# Altium project RGB_Matrix.PrjPcb (part 1 of 2)
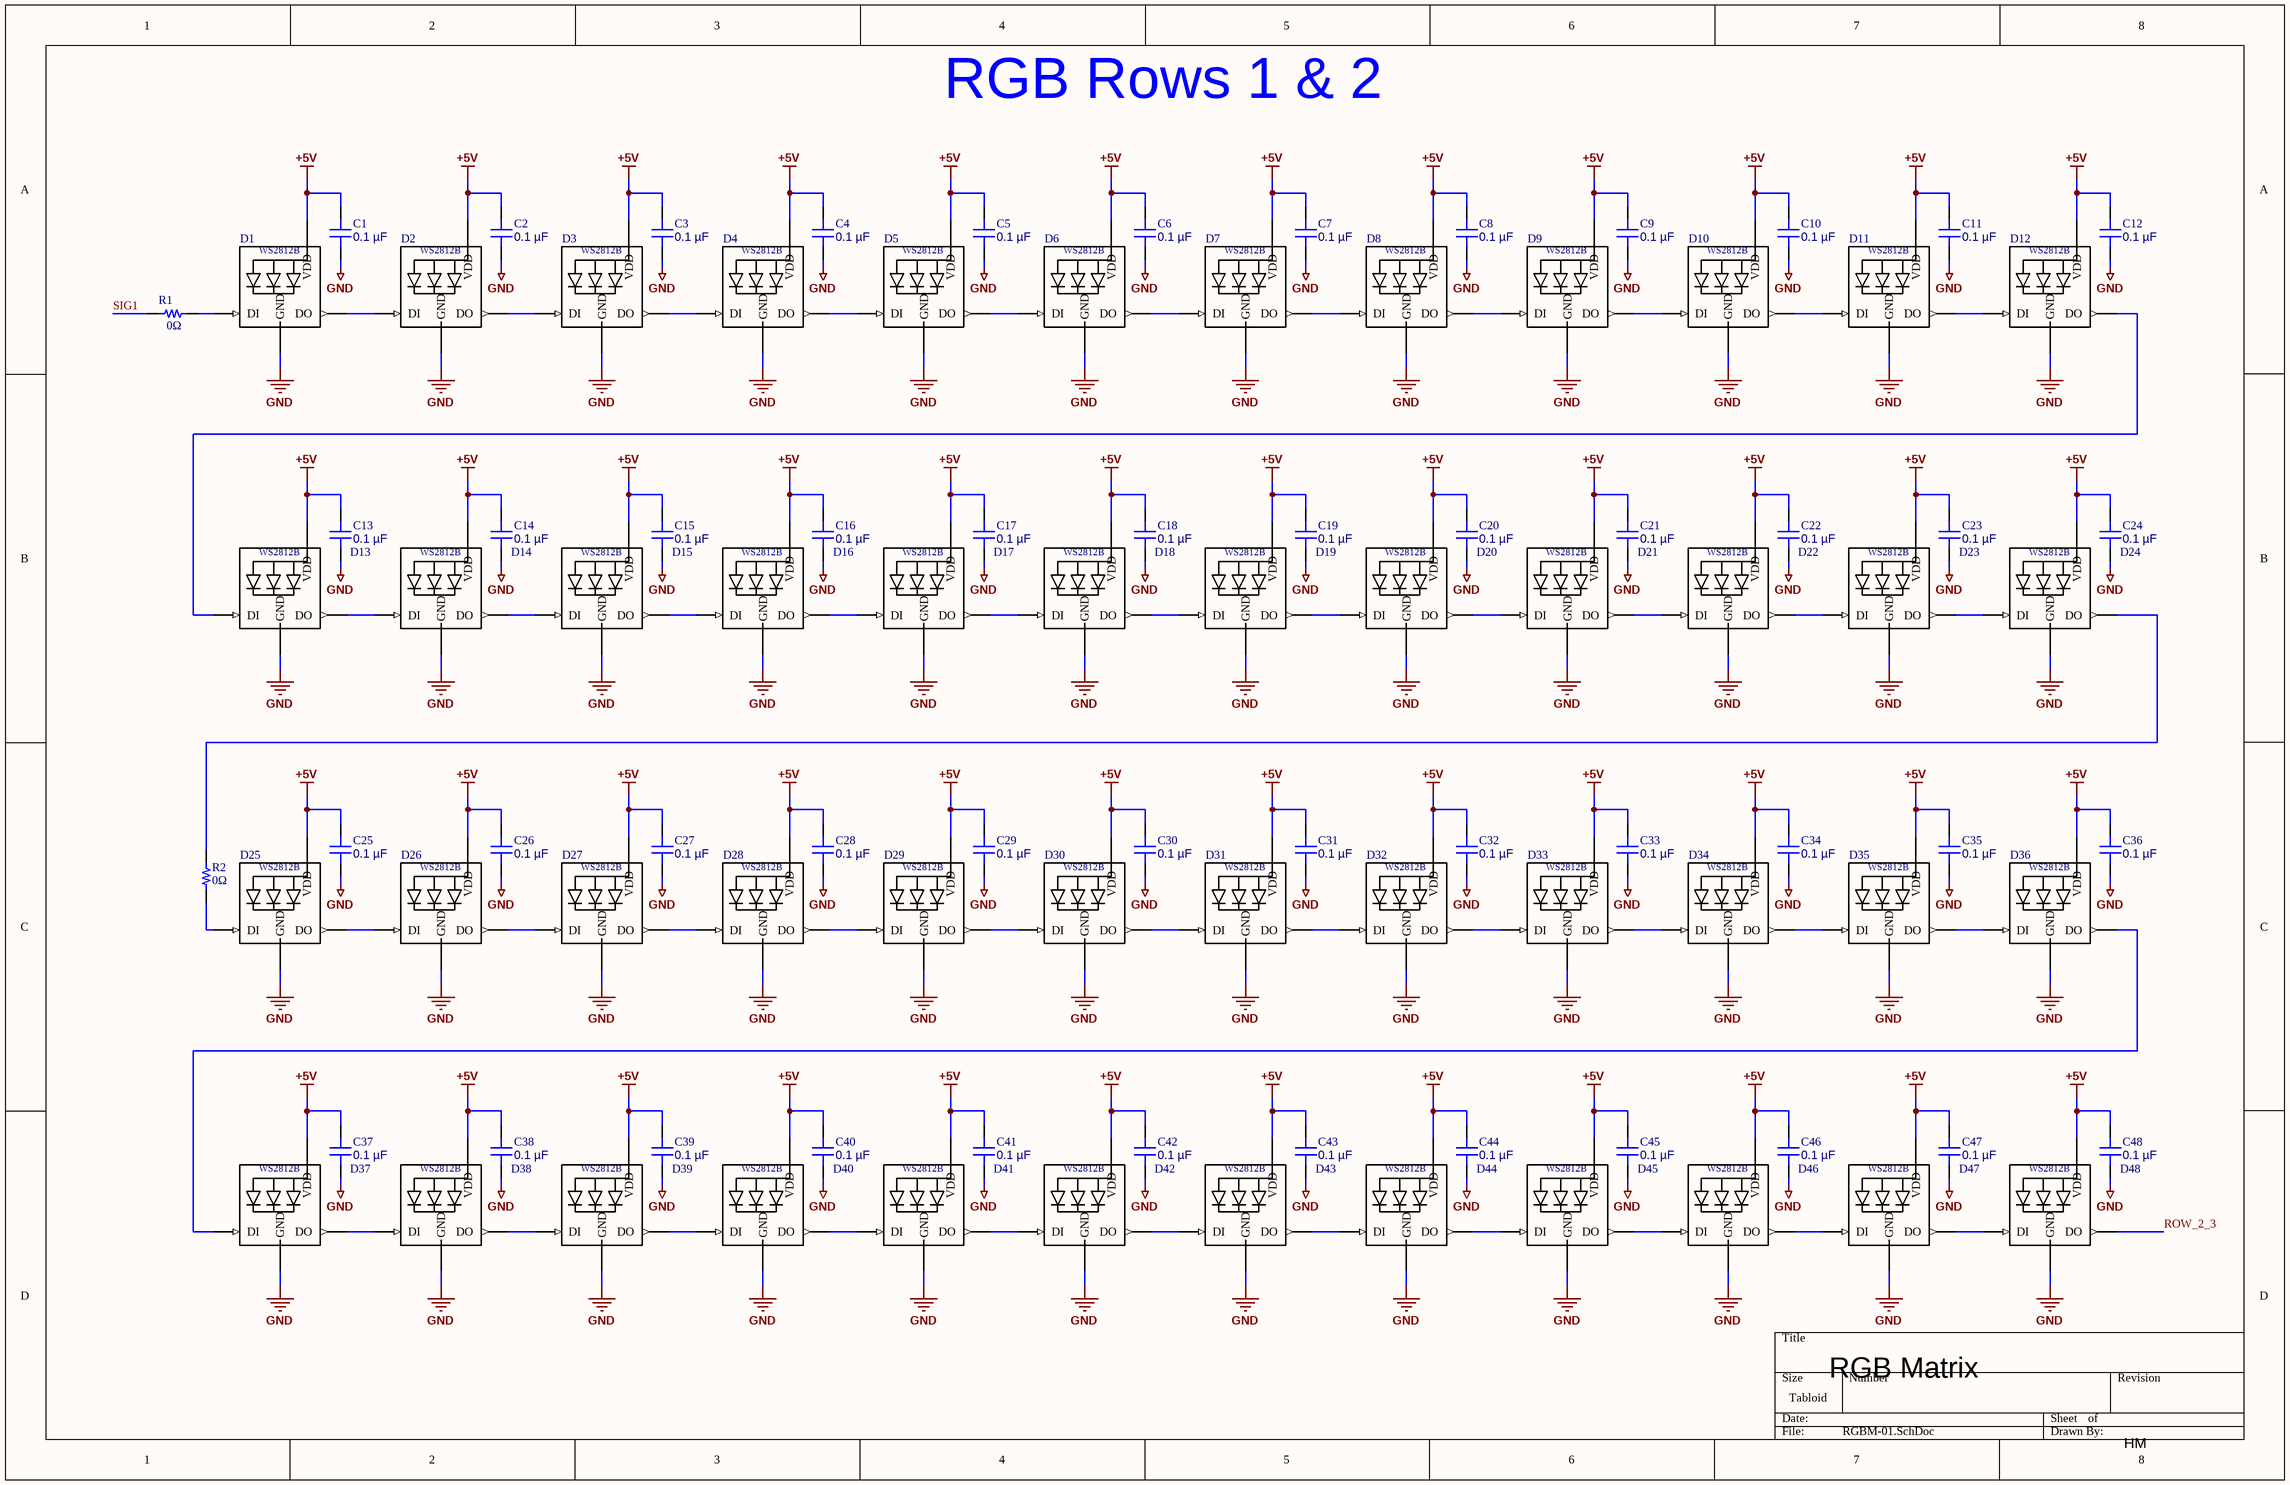
[diagram p0: RGBM-01.SchDoc]
7 sheets, 598 parts. Net scope: global (net labels, ports and power ports of the same name join across sheets).
Board file: RGBM.PcbDoc
Sheets:
  RGBM-01.SchDoc
  RGBM-02.SchDoc
  RGBM-03.SchDoc
  RGBM-04.SchDoc
  RGBM-05.SchDoc
  RGBM-06.SchDoc
  RGBM-07.SchDoc

## Sheet RGBM-01.SchDoc
size Tabloid; SheetNumber: 1; SheetTotal: 7

### Parts
C1  0.1 µF  [CAP 0603_1608]
C2  0.1 µF  [CAP 0603_1608]
C3  0.1 µF  [CAP 0603_1608]
C4  0.1 µF  [CAP 0603_1608]
C5  0.1 µF  [CAP 0603_1608]
C6  0.1 µF  [CAP 0603_1608]
C7  0.1 µF  [CAP 0603_1608]
C8  0.1 µF  [CAP 0603_1608]
C9  0.1 µF  [CAP 0603_1608]
C10  0.1 µF  [CAP 0603_1608]
C11  0.1 µF  [CAP 0603_1608]
C12  0.1 µF  [CAP 0603_1608]
C13  0.1 µF  [CAP 0603_1608]
C14  0.1 µF  [CAP 0603_1608]
C15  0.1 µF  [CAP 0603_1608]
C16  0.1 µF  [CAP 0603_1608]
C17  0.1 µF  [CAP 0603_1608]
C18  0.1 µF  [CAP 0603_1608]
C19  0.1 µF  [CAP 0603_1608]
C20  0.1 µF  [CAP 0603_1608]
C21  0.1 µF  [CAP 0603_1608]
C22  0.1 µF  [CAP 0603_1608]
C23  0.1 µF  [CAP 0603_1608]
C24  0.1 µF  [CAP 0603_1608]
C25  0.1 µF  [CAP 0603_1608]
C26  0.1 µF  [CAP 0603_1608]
C27  0.1 µF  [CAP 0603_1608]
C28  0.1 µF  [CAP 0603_1608]
C29  0.1 µF  [CAP 0603_1608]
C30  0.1 µF  [CAP 0603_1608]
C31  0.1 µF  [CAP 0603_1608]
C32  0.1 µF  [CAP 0603_1608]
C33  0.1 µF  [CAP 0603_1608]
C34  0.1 µF  [CAP 0603_1608]
C35  0.1 µF  [CAP 0603_1608]
C36  0.1 µF  [CAP 0603_1608]
C37  0.1 µF  [CAP 0603_1608]
C38  0.1 µF  [CAP 0603_1608]
C39  0.1 µF  [CAP 0603_1608]
C40  0.1 µF  [CAP 0603_1608]
C41  0.1 µF  [CAP 0603_1608]
C42  0.1 µF  [CAP 0603_1608]
C43  0.1 µF  [CAP 0603_1608]
C44  0.1 µF  [CAP 0603_1608]
C45  0.1 µF  [CAP 0603_1608]
C46  0.1 µF  [CAP 0603_1608]
C47  0.1 µF  [CAP 0603_1608]
C48  0.1 µF  [CAP 0603_1608]
D1  WS2812B  [*WS2812B_WS2812B(Primary)]  (value not drawn)
D2  WS2812B  [*WS2812B_WS2812B(Primary)]  (value not drawn)
D3  WS2812B  [*WS2812B_WS2812B(Primary)]  (value not drawn)
D4  WS2812B  [*WS2812B_WS2812B(Primary)]  (value not drawn)
D5  WS2812B  [*WS2812B_WS2812B(Primary)]  (value not drawn)
D6  WS2812B  [*WS2812B_WS2812B(Primary)]  (value not drawn)
D7  WS2812B  [*WS2812B_WS2812B(Primary)]  (value not drawn)
D8  WS2812B  [*WS2812B_WS2812B(Primary)]  (value not drawn)
D9  WS2812B  [*WS2812B_WS2812B(Primary)]  (value not drawn)
D10  WS2812B  [*WS2812B_WS2812B(Primary)]  (value not drawn)
D11  WS2812B  [*WS2812B_WS2812B(Primary)]  (value not drawn)
D12  WS2812B  [*WS2812B_WS2812B(Primary)]  (value not drawn)
D13  WS2812B  [*WS2812B_WS2812B(Primary)]  (value not drawn)
D14  WS2812B  [*WS2812B_WS2812B(Primary)]  (value not drawn)
D15  WS2812B  [*WS2812B_WS2812B(Primary)]  (value not drawn)
D16  WS2812B  [*WS2812B_WS2812B(Primary)]  (value not drawn)
D17  WS2812B  [*WS2812B_WS2812B(Primary)]  (value not drawn)
D18  WS2812B  [*WS2812B_WS2812B(Primary)]  (value not drawn)
D19  WS2812B  [*WS2812B_WS2812B(Primary)]  (value not drawn)
D20  WS2812B  [*WS2812B_WS2812B(Primary)]  (value not drawn)
D21  WS2812B  [*WS2812B_WS2812B(Primary)]  (value not drawn)
D22  WS2812B  [*WS2812B_WS2812B(Primary)]  (value not drawn)
D23  WS2812B  [*WS2812B_WS2812B(Primary)]  (value not drawn)
D24  WS2812B  [*WS2812B_WS2812B(Primary)]  (value not drawn)
D25  WS2812B  [*WS2812B_WS2812B(Primary)]  (value not drawn)
D26  WS2812B  [*WS2812B_WS2812B(Primary)]  (value not drawn)
D27  WS2812B  [*WS2812B_WS2812B(Primary)]  (value not drawn)
D28  WS2812B  [*WS2812B_WS2812B(Primary)]  (value not drawn)
D29  WS2812B  [*WS2812B_WS2812B(Primary)]  (value not drawn)
D30  WS2812B  [*WS2812B_WS2812B(Primary)]  (value not drawn)
D31  WS2812B  [*WS2812B_WS2812B(Primary)]  (value not drawn)
D32  WS2812B  [*WS2812B_WS2812B(Primary)]  (value not drawn)
D33  WS2812B  [*WS2812B_WS2812B(Primary)]  (value not drawn)
D34  WS2812B  [*WS2812B_WS2812B(Primary)]  (value not drawn)
D35  WS2812B  [*WS2812B_WS2812B(Primary)]  (value not drawn)
D36  WS2812B  [*WS2812B_WS2812B(Primary)]  (value not drawn)
D37  WS2812B  [*WS2812B_WS2812B(Primary)]  (value not drawn)
D38  WS2812B  [*WS2812B_WS2812B(Primary)]  (value not drawn)
D39  WS2812B  [*WS2812B_WS2812B(Primary)]  (value not drawn)
D40  WS2812B  [*WS2812B_WS2812B(Primary)]  (value not drawn)
D41  WS2812B  [*WS2812B_WS2812B(Primary)]  (value not drawn)
D42  WS2812B  [*WS2812B_WS2812B(Primary)]  (value not drawn)
D43  WS2812B  [*WS2812B_WS2812B(Primary)]  (value not drawn)
D44  WS2812B  [*WS2812B_WS2812B(Primary)]  (value not drawn)
D45  WS2812B  [*WS2812B_WS2812B(Primary)]  (value not drawn)
D46  WS2812B  [*WS2812B_WS2812B(Primary)]  (value not drawn)
D47  WS2812B  [*WS2812B_WS2812B(Primary)]  (value not drawn)
D48  WS2812B  [*WS2812B_WS2812B(Primary)]  (value not drawn)
R1  0Ω  [RES 0603_1608]
R2  0Ω  [RES 0603_1608]

### Nets
+5V: C1.2 C2.2 C3.2 C4.2 C5.2 C6.2 C7.2 C8.2 C9.2 C10.2 C11.2 C12.2 C13.2 C14.2 C15.2 C16.2 C17.2 C18.2 C19.2 C20.2 C21.2 C22.2 C23.2 C24.2 C25.2 C26.2 C27.2 C28.2 C29.2 C30.2 C31.2 C32.2 C33.2 C34.2 C35.2 C36.2 C37.2 C38.2 C39.2 C40.2 C41.2 C42.2 C43.2 C44.2 C45.2 C46.2 C47.2 C48.2 D1.1-VDD(VDD) D2.1-VDD(VDD) D3.1-VDD(VDD) D4.1-VDD(VDD) D5.1-VDD(VDD) D6.1-VDD(VDD) D7.1-VDD(VDD) D8.1-VDD(VDD) D9.1-VDD(VDD) D10.1-VDD(VDD) D11.1-VDD(VDD) D12.1-VDD(VDD) D13.1-VDD(VDD) D14.1-VDD(VDD) D15.1-VDD(VDD) D16.1-VDD(VDD) D17.1-VDD(VDD) D18.1-VDD(VDD) D19.1-VDD(VDD) D20.1-VDD(VDD) D21.1-VDD(VDD) D22.1-VDD(VDD) D23.1-VDD(VDD) D24.1-VDD(VDD) D25.1-VDD(VDD) D26.1-VDD(VDD) D27.1-VDD(VDD) D28.1-VDD(VDD) D29.1-VDD(VDD) D30.1-VDD(VDD) D31.1-VDD(VDD) D32.1-VDD(VDD) D33.1-VDD(VDD) D34.1-VDD(VDD) D35.1-VDD(VDD) D36.1-VDD(VDD) D37.1-VDD(VDD) D38.1-VDD(VDD) D39.1-VDD(VDD) D40.1-VDD(VDD) D41.1-VDD(VDD) D42.1-VDD(VDD) D43.1-VDD(VDD) D44.1-VDD(VDD) D45.1-VDD(VDD) D46.1-VDD(VDD) D47.1-VDD(VDD) D48.1-VDD(VDD)
GND: C1.1 C2.1 C3.1 C4.1 C5.1 C6.1 C7.1 C8.1 C9.1 C10.1 C11.1 C12.1 C13.1 C14.1 C15.1 C16.1 C17.1 C18.1 C19.1 C20.1 C21.1 C22.1 C23.1 C24.1 C25.1 C26.1 C27.1 C28.1 C29.1 C30.1 C31.1 C32.1 C33.1 C34.1 C35.1 C36.1 C37.1 C38.1 C39.1 C40.1 C41.1 C42.1 C43.1 C44.1 C45.1 C46.1 C47.1 C48.1 D1.3-GND(GND) D2.3-GND(GND) D3.3-GND(GND) D4.3-GND(GND) D5.3-GND(GND) D6.3-GND(GND) D7.3-GND(GND) D8.3-GND(GND) D9.3-GND(GND) D10.3-GND(GND) D11.3-GND(GND) D12.3-GND(GND) D13.3-GND(GND) D14.3-GND(GND) D15.3-GND(GND) D16.3-GND(GND) D17.3-GND(GND) D18.3-GND(GND) D19.3-GND(GND) D20.3-GND(GND) D21.3-GND(GND) D22.3-GND(GND) D23.3-GND(GND) D24.3-GND(GND) D25.3-GND(GND) D26.3-GND(GND) D27.3-GND(GND) D28.3-GND(GND) D29.3-GND(GND) D30.3-GND(GND) D31.3-GND(GND) D32.3-GND(GND) D33.3-GND(GND) D34.3-GND(GND) D35.3-GND(GND) D36.3-GND(GND) D37.3-GND(GND) D38.3-GND(GND) D39.3-GND(GND) D40.3-GND(GND) D41.3-GND(GND) D42.3-GND(GND) D43.3-GND(GND) D44.3-GND(GND) D45.3-GND(GND) D46.3-GND(GND) D47.3-GND(GND) D48.3-GND(GND)
ROW_2_3: D48.2-DOUT(DO)
SIG1: R1.1
NetD1_2-DOUT: D1.2-DOUT(DO) D2.4-DIN(DI)
NetD1_4-DIN: D1.4-DIN(DI) R1.2
NetD2_2-DOUT: D2.2-DOUT(DO) D3.4-DIN(DI)
NetD3_2-DOUT: D3.2-DOUT(DO) D4.4-DIN(DI)
NetD4_2-DOUT: D4.2-DOUT(DO) D5.4-DIN(DI)
NetD5_2-DOUT: D5.2-DOUT(DO) D6.4-DIN(DI)
NetD6_2-DOUT: D6.2-DOUT(DO) D7.4-DIN(DI)
NetD7_2-DOUT: D7.2-DOUT(DO) D8.4-DIN(DI)
NetD8_2-DOUT: D8.2-DOUT(DO) D9.4-DIN(DI)
NetD9_2-DOUT: D9.2-DOUT(DO) D10.4-DIN(DI)
NetD10_2-DOUT: D10.2-DOUT(DO) D11.4-DIN(DI)
NetD11_2-DOUT: D11.2-DOUT(DO) D12.4-DIN(DI)
NetD12_2-DOUT: D12.2-DOUT(DO) D13.4-DIN(DI)
NetD13_2-DOUT: D13.2-DOUT(DO) D14.4-DIN(DI)
NetD14_2-DOUT: D14.2-DOUT(DO) D15.4-DIN(DI)
NetD15_2-DOUT: D15.2-DOUT(DO) D16.4-DIN(DI)
NetD16_2-DOUT: D16.2-DOUT(DO) D17.4-DIN(DI)
NetD17_2-DOUT: D17.2-DOUT(DO) D18.4-DIN(DI)
NetD18_2-DOUT: D18.2-DOUT(DO) D19.4-DIN(DI)
NetD19_2-DOUT: D19.2-DOUT(DO) D20.4-DIN(DI)
NetD20_2-DOUT: D20.2-DOUT(DO) D21.4-DIN(DI)
NetD21_2-DOUT: D21.2-DOUT(DO) D22.4-DIN(DI)
NetD22_2-DOUT: D22.2-DOUT(DO) D23.4-DIN(DI)
NetD23_2-DOUT: D23.2-DOUT(DO) D24.4-DIN(DI)
NetD24_2-DOUT: D24.2-DOUT(DO) R2.2
NetD25_2-DOUT: D25.2-DOUT(DO) D26.4-DIN(DI)
NetD25_4-DIN: D25.4-DIN(DI) R2.1
NetD26_2-DOUT: D26.2-DOUT(DO) D27.4-DIN(DI)
NetD27_2-DOUT: D27.2-DOUT(DO) D28.4-DIN(DI)
NetD28_2-DOUT: D28.2-DOUT(DO) D29.4-DIN(DI)
NetD29_2-DOUT: D29.2-DOUT(DO) D30.4-DIN(DI)
NetD30_2-DOUT: D30.2-DOUT(DO) D31.4-DIN(DI)
NetD31_2-DOUT: D31.2-DOUT(DO) D32.4-DIN(DI)
NetD32_2-DOUT: D32.2-DOUT(DO) D33.4-DIN(DI)
NetD33_2-DOUT: D33.2-DOUT(DO) D34.4-DIN(DI)
NetD34_2-DOUT: D34.2-DOUT(DO) D35.4-DIN(DI)
NetD35_2-DOUT: D35.2-DOUT(DO) D36.4-DIN(DI)
NetD36_2-DOUT: D36.2-DOUT(DO) D37.4-DIN(DI)
NetD37_2-DOUT: D37.2-DOUT(DO) D38.4-DIN(DI)
NetD38_2-DOUT: D38.2-DOUT(DO) D39.4-DIN(DI)
NetD39_2-DOUT: D39.2-DOUT(DO) D40.4-DIN(DI)
NetD40_2-DOUT: D40.2-DOUT(DO) D41.4-DIN(DI)
NetD41_2-DOUT: D41.2-DOUT(DO) D42.4-DIN(DI)
NetD42_2-DOUT: D42.2-DOUT(DO) D43.4-DIN(DI)
NetD43_2-DOUT: D43.2-DOUT(DO) D44.4-DIN(DI)
NetD44_2-DOUT: D44.2-DOUT(DO) D45.4-DIN(DI)
NetD45_2-DOUT: D45.2-DOUT(DO) D46.4-DIN(DI)
NetD46_2-DOUT: D46.2-DOUT(DO) D47.4-DIN(DI)
NetD47_2-DOUT: D47.2-DOUT(DO) D48.4-DIN(DI)

### Notes on the sheet
- RGB Rows 1 & 2
- RGB Matrix
- HM

### Library data of the parts
C1-C48 = C0603C104K5RAC7411: CAP CER 0.1UF 50V X7R 0603; manufacturer: KEMET; Tolerance: ±10%; Part Number: C0603C104K5RAC7411; Capacitance: 0.1 µF; Applications: Bypass, Decoupling; componentlink1description: Datasheet; componentlink1url: https://api.kemet.com/component-edge/download/datasheet/C0603C104K5RAC7411.pdf; componentlink2description: DigiKey Link; componentlink2url: https://www.digikey.com/en/products/detail/kemet/C0603C104K5RAC7411/3317013; Device Package: 0603 (1608 Metric); lastupdated: 2026-04-06 7:23:52 PM; Lifecycle Status: Active; Minimum Order: 1; Mounting Type: Surface Mount, MLCC; Operating Temperature: -55°C ~ 125°C; Package / Case: 0603 (1608 Metric); packaging: TapeAndReel; partid: 2233; Part Status: Active; price: 0.01; series: SMD Comm X7R; Size / Dimension: 0.063" L x 0.031" W (1.60mm x 0.80mm); Supplier 1: DigiKey; Supplier Part Number 1: 399-C0603C104K5RAC7411CT-ND; Temperature Coefficient: X7R; Thickness (Max): 0.035" (0.90mm); value: 0.1 µF; Voltage - Rated: 50V
D1-D48 = WS2812B: Intelligent control LED integrated light source; MF: Worldsemi; SnapEDA_Link: https://www.snapeda.com/parts/WS2812B/Worldsemi/view-part/?ref=snap; Package: None; MP: WS2812B; Check_prices: https://www.snapeda.com/parts/WS2812B/Worldsemi/view-part/?ref=eda; Value: *
R1 R2 = YJP1608-R001: RES SMD 0 OHM JUMPER 0603; Manufacturer: Susumu; Value: 0 Ohms; Part Number: YJP1608-R001; ComponentLink1Description: Datasheet; ComponentLink1URL: http://www.susumu.co.jp/common/pdf/n_catalog_partition10_en.pdf; ComponentLink2Description: DigiKey Link; ComponentLink2URL: https://www.digikey.com/en/products/detail/susumu/YJP1608-R001/2815047; Composition: Thin Film; Device Package: 0603 (1608 Metric); Height - Seated (Max): 0.016" (0.40mm); LastUpdated: 2024-02-09 8:42:50 PM; Lifecycle Status: Active; Minimum Order: 1; Number of Terminations: 2; Operating Temperature: -40°C ~ 125°C; Package / Case: 0603 (1608 Metric); Packaging: TapeAndReel; PartId: 16802; Part Status: Active; Price: 0.08; Resistance: 0 Ohms; Series: YJP; Size / Dimension: 0.063" L x 0.031" W (1.60mm x 0.80mm); Supplier 1: DigiKey; Supplier Part Number 1: 408-1515-1-ND; Supplier Device Package: 0603; Tolerance: Jumper

## Sheet RGBM-02.SchDoc
size Tabloid; SheetNumber: 2; SheetTotal: 7
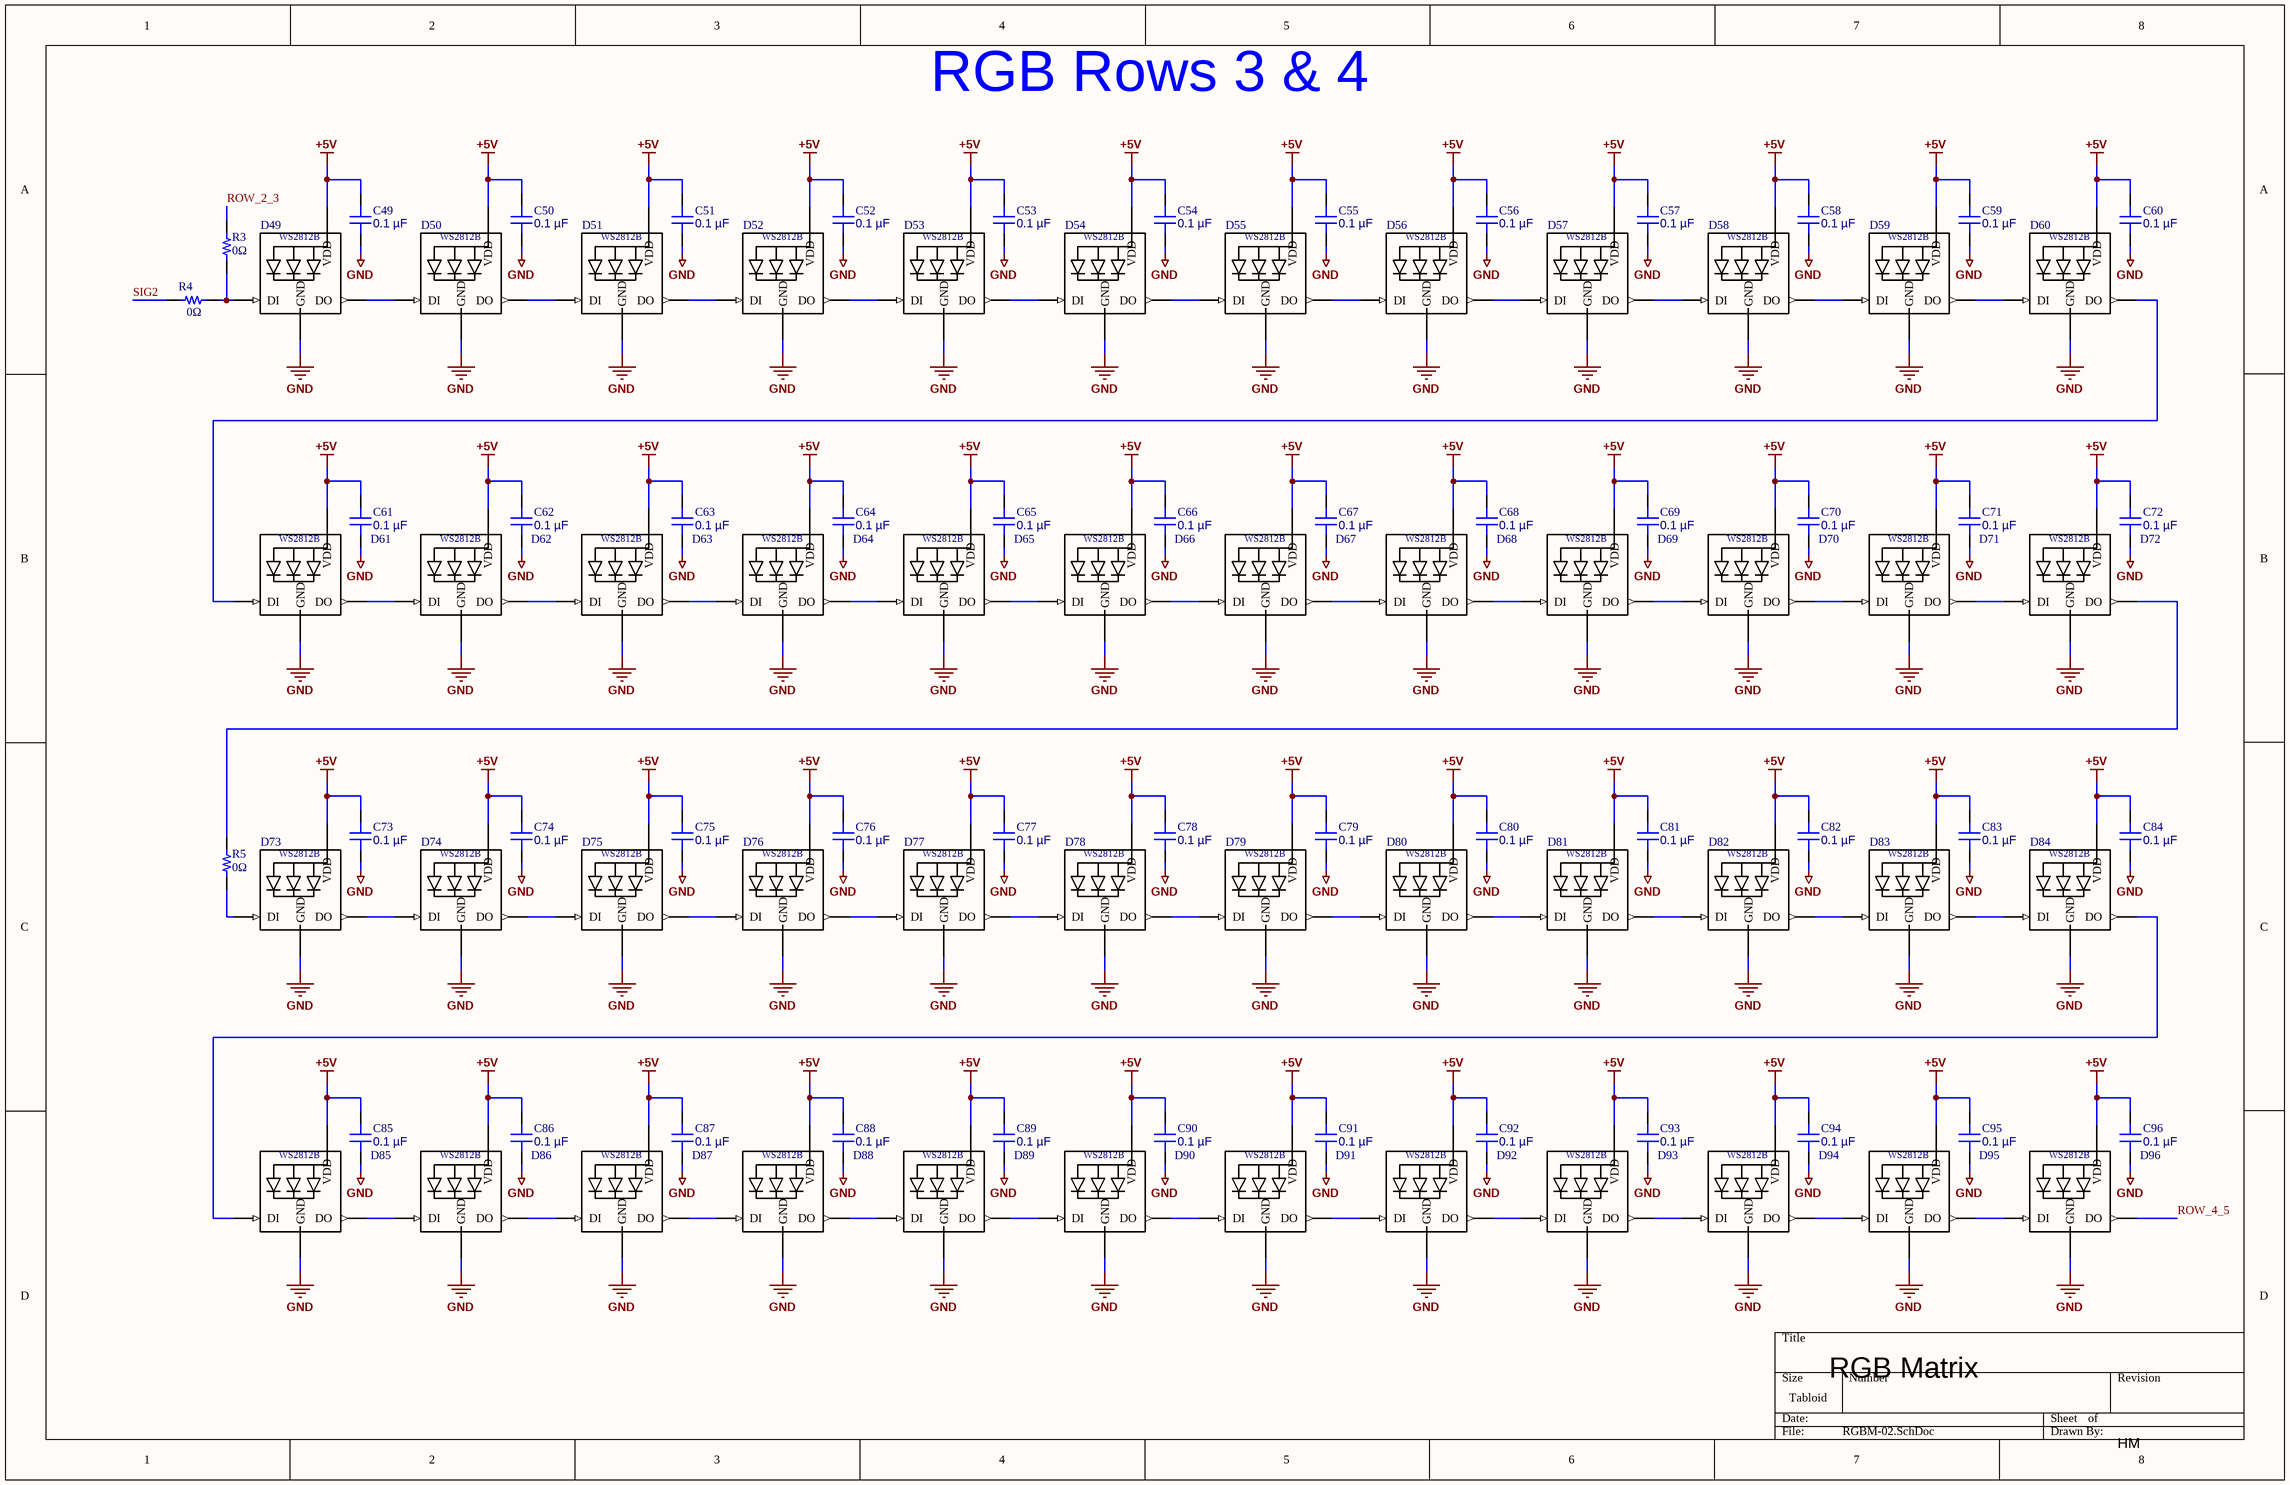
[diagram p1: RGBM-02.SchDoc]

### Parts
C49  0.1 µF  [CAP 0603_1608]
C50  0.1 µF  [CAP 0603_1608]
C51  0.1 µF  [CAP 0603_1608]
C52  0.1 µF  [CAP 0603_1608]
C53  0.1 µF  [CAP 0603_1608]
C54  0.1 µF  [CAP 0603_1608]
C55  0.1 µF  [CAP 0603_1608]
C56  0.1 µF  [CAP 0603_1608]
C57  0.1 µF  [CAP 0603_1608]
C58  0.1 µF  [CAP 0603_1608]
C59  0.1 µF  [CAP 0603_1608]
C60  0.1 µF  [CAP 0603_1608]
C61  0.1 µF  [CAP 0603_1608]
C62  0.1 µF  [CAP 0603_1608]
C63  0.1 µF  [CAP 0603_1608]
C64  0.1 µF  [CAP 0603_1608]
C65  0.1 µF  [CAP 0603_1608]
C66  0.1 µF  [CAP 0603_1608]
C67  0.1 µF  [CAP 0603_1608]
C68  0.1 µF  [CAP 0603_1608]
C69  0.1 µF  [CAP 0603_1608]
C70  0.1 µF  [CAP 0603_1608]
C71  0.1 µF  [CAP 0603_1608]
C72  0.1 µF  [CAP 0603_1608]
C73  0.1 µF  [CAP 0603_1608]
C74  0.1 µF  [CAP 0603_1608]
C75  0.1 µF  [CAP 0603_1608]
C76  0.1 µF  [CAP 0603_1608]
C77  0.1 µF  [CAP 0603_1608]
C78  0.1 µF  [CAP 0603_1608]
C79  0.1 µF  [CAP 0603_1608]
C80  0.1 µF  [CAP 0603_1608]
C81  0.1 µF  [CAP 0603_1608]
C82  0.1 µF  [CAP 0603_1608]
C83  0.1 µF  [CAP 0603_1608]
C84  0.1 µF  [CAP 0603_1608]
C85  0.1 µF  [CAP 0603_1608]
C86  0.1 µF  [CAP 0603_1608]
C87  0.1 µF  [CAP 0603_1608]
C88  0.1 µF  [CAP 0603_1608]
C89  0.1 µF  [CAP 0603_1608]
C90  0.1 µF  [CAP 0603_1608]
C91  0.1 µF  [CAP 0603_1608]
C92  0.1 µF  [CAP 0603_1608]
C93  0.1 µF  [CAP 0603_1608]
C94  0.1 µF  [CAP 0603_1608]
C95  0.1 µF  [CAP 0603_1608]
C96  0.1 µF  [CAP 0603_1608]
D49  WS2812B  [*WS2812B_WS2812B(Primary)]  (value not drawn)
D50  WS2812B  [*WS2812B_WS2812B(Primary)]  (value not drawn)
D51  WS2812B  [*WS2812B_WS2812B(Primary)]  (value not drawn)
D52  WS2812B  [*WS2812B_WS2812B(Primary)]  (value not drawn)
D53  WS2812B  [*WS2812B_WS2812B(Primary)]  (value not drawn)
D54  WS2812B  [*WS2812B_WS2812B(Primary)]  (value not drawn)
D55  WS2812B  [*WS2812B_WS2812B(Primary)]  (value not drawn)
D56  WS2812B  [*WS2812B_WS2812B(Primary)]  (value not drawn)
D57  WS2812B  [*WS2812B_WS2812B(Primary)]  (value not drawn)
D58  WS2812B  [*WS2812B_WS2812B(Primary)]  (value not drawn)
D59  WS2812B  [*WS2812B_WS2812B(Primary)]  (value not drawn)
D60  WS2812B  [*WS2812B_WS2812B(Primary)]  (value not drawn)
D61  WS2812B  [*WS2812B_WS2812B(Primary)]  (value not drawn)
D62  WS2812B  [*WS2812B_WS2812B(Primary)]  (value not drawn)
D63  WS2812B  [*WS2812B_WS2812B(Primary)]  (value not drawn)
D64  WS2812B  [*WS2812B_WS2812B(Primary)]  (value not drawn)
D65  WS2812B  [*WS2812B_WS2812B(Primary)]  (value not drawn)
D66  WS2812B  [*WS2812B_WS2812B(Primary)]  (value not drawn)
D67  WS2812B  [*WS2812B_WS2812B(Primary)]  (value not drawn)
D68  WS2812B  [*WS2812B_WS2812B(Primary)]  (value not drawn)
D69  WS2812B  [*WS2812B_WS2812B(Primary)]  (value not drawn)
D70  WS2812B  [*WS2812B_WS2812B(Primary)]  (value not drawn)
D71  WS2812B  [*WS2812B_WS2812B(Primary)]  (value not drawn)
D72  WS2812B  [*WS2812B_WS2812B(Primary)]  (value not drawn)
D73  WS2812B  [*WS2812B_WS2812B(Primary)]  (value not drawn)
D74  WS2812B  [*WS2812B_WS2812B(Primary)]  (value not drawn)
D75  WS2812B  [*WS2812B_WS2812B(Primary)]  (value not drawn)
D76  WS2812B  [*WS2812B_WS2812B(Primary)]  (value not drawn)
D77  WS2812B  [*WS2812B_WS2812B(Primary)]  (value not drawn)
D78  WS2812B  [*WS2812B_WS2812B(Primary)]  (value not drawn)
D79  WS2812B  [*WS2812B_WS2812B(Primary)]  (value not drawn)
D80  WS2812B  [*WS2812B_WS2812B(Primary)]  (value not drawn)
D81  WS2812B  [*WS2812B_WS2812B(Primary)]  (value not drawn)
D82  WS2812B  [*WS2812B_WS2812B(Primary)]  (value not drawn)
D83  WS2812B  [*WS2812B_WS2812B(Primary)]  (value not drawn)
D84  WS2812B  [*WS2812B_WS2812B(Primary)]  (value not drawn)
D85  WS2812B  [*WS2812B_WS2812B(Primary)]  (value not drawn)
D86  WS2812B  [*WS2812B_WS2812B(Primary)]  (value not drawn)
D87  WS2812B  [*WS2812B_WS2812B(Primary)]  (value not drawn)
D88  WS2812B  [*WS2812B_WS2812B(Primary)]  (value not drawn)
D89  WS2812B  [*WS2812B_WS2812B(Primary)]  (value not drawn)
D90  WS2812B  [*WS2812B_WS2812B(Primary)]  (value not drawn)
D91  WS2812B  [*WS2812B_WS2812B(Primary)]  (value not drawn)
D92  WS2812B  [*WS2812B_WS2812B(Primary)]  (value not drawn)
D93  WS2812B  [*WS2812B_WS2812B(Primary)]  (value not drawn)
D94  WS2812B  [*WS2812B_WS2812B(Primary)]  (value not drawn)
D95  WS2812B  [*WS2812B_WS2812B(Primary)]  (value not drawn)
D96  WS2812B  [*WS2812B_WS2812B(Primary)]  (value not drawn)
R3  0Ω  [RES 0603_1608]
R4  0Ω  [RES 0603_1608]
R5  0Ω  [RES 0603_1608]

### Nets
+5V: C49.2 C50.2 C51.2 C52.2 C53.2 C54.2 C55.2 C56.2 C57.2 C58.2 C59.2 C60.2 C61.2 C62.2 C63.2 C64.2 C65.2 C66.2 C67.2 C68.2 C69.2 C70.2 C71.2 C72.2 C73.2 C74.2 C75.2 C76.2 C77.2 C78.2 C79.2 C80.2 C81.2 C82.2 C83.2 C84.2 C85.2 C86.2 C87.2 C88.2 C89.2 C90.2 C91.2 C92.2 C93.2 C94.2 C95.2 C96.2 D49.1-VDD(VDD) D50.1-VDD(VDD) D51.1-VDD(VDD) D52.1-VDD(VDD) D53.1-VDD(VDD) D54.1-VDD(VDD) D55.1-VDD(VDD) D56.1-VDD(VDD) D57.1-VDD(VDD) D58.1-VDD(VDD) D59.1-VDD(VDD) D60.1-VDD(VDD) D61.1-VDD(VDD) D62.1-VDD(VDD) D63.1-VDD(VDD) D64.1-VDD(VDD) D65.1-VDD(VDD) D66.1-VDD(VDD) D67.1-VDD(VDD) D68.1-VDD(VDD) D69.1-VDD(VDD) D70.1-VDD(VDD) D71.1-VDD(VDD) D72.1-VDD(VDD) D73.1-VDD(VDD) D74.1-VDD(VDD) D75.1-VDD(VDD) D76.1-VDD(VDD) D77.1-VDD(VDD) D78.1-VDD(VDD) D79.1-VDD(VDD) D80.1-VDD(VDD) D81.1-VDD(VDD) D82.1-VDD(VDD) D83.1-VDD(VDD) D84.1-VDD(VDD) D85.1-VDD(VDD) D86.1-VDD(VDD) D87.1-VDD(VDD) D88.1-VDD(VDD) D89.1-VDD(VDD) D90.1-VDD(VDD) D91.1-VDD(VDD) D92.1-VDD(VDD) D93.1-VDD(VDD) D94.1-VDD(VDD) D95.1-VDD(VDD) D96.1-VDD(VDD)
GND: C49.1 C50.1 C51.1 C52.1 C53.1 C54.1 C55.1 C56.1 C57.1 C58.1 C59.1 C60.1 C61.1 C62.1 C63.1 C64.1 C65.1 C66.1 C67.1 C68.1 C69.1 C70.1 C71.1 C72.1 C73.1 C74.1 C75.1 C76.1 C77.1 C78.1 C79.1 C80.1 C81.1 C82.1 C83.1 C84.1 C85.1 C86.1 C87.1 C88.1 C89.1 C90.1 C91.1 C92.1 C93.1 C94.1 C95.1 C96.1 D49.3-GND(GND) D50.3-GND(GND) D51.3-GND(GND) D52.3-GND(GND) D53.3-GND(GND) D54.3-GND(GND) D55.3-GND(GND) D56.3-GND(GND) D57.3-GND(GND) D58.3-GND(GND) D59.3-GND(GND) D60.3-GND(GND) D61.3-GND(GND) D62.3-GND(GND) D63.3-GND(GND) D64.3-GND(GND) D65.3-GND(GND) D66.3-GND(GND) D67.3-GND(GND) D68.3-GND(GND) D69.3-GND(GND) D70.3-GND(GND) D71.3-GND(GND) D72.3-GND(GND) D73.3-GND(GND) D74.3-GND(GND) D75.3-GND(GND) D76.3-GND(GND) D77.3-GND(GND) D78.3-GND(GND) D79.3-GND(GND) D80.3-GND(GND) D81.3-GND(GND) D82.3-GND(GND) D83.3-GND(GND) D84.3-GND(GND) D85.3-GND(GND) D86.3-GND(GND) D87.3-GND(GND) D88.3-GND(GND) D89.3-GND(GND) D90.3-GND(GND) D91.3-GND(GND) D92.3-GND(GND) D93.3-GND(GND) D94.3-GND(GND) D95.3-GND(GND) D96.3-GND(GND)
ROW_2_3: R3.2
ROW_4_5: D96.2-DOUT(DO)
SIG2: R4.1
NetD49_2-DOUT: D49.2-DOUT(DO) D50.4-DIN(DI)
NetD49_4-DIN: D49.4-DIN(DI) R3.1 R4.2
NetD50_2-DOUT: D50.2-DOUT(DO) D51.4-DIN(DI)
NetD51_2-DOUT: D51.2-DOUT(DO) D52.4-DIN(DI)
NetD52_2-DOUT: D52.2-DOUT(DO) D53.4-DIN(DI)
NetD53_2-DOUT: D53.2-DOUT(DO) D54.4-DIN(DI)
NetD54_2-DOUT: D54.2-DOUT(DO) D55.4-DIN(DI)
NetD55_2-DOUT: D55.2-DOUT(DO) D56.4-DIN(DI)
NetD56_2-DOUT: D56.2-DOUT(DO) D57.4-DIN(DI)
NetD57_2-DOUT: D57.2-DOUT(DO) D58.4-DIN(DI)
NetD58_2-DOUT: D58.2-DOUT(DO) D59.4-DIN(DI)
NetD59_2-DOUT: D59.2-DOUT(DO) D60.4-DIN(DI)
NetD60_2-DOUT: D60.2-DOUT(DO) D61.4-DIN(DI)
NetD61_2-DOUT: D61.2-DOUT(DO) D62.4-DIN(DI)
NetD62_2-DOUT: D62.2-DOUT(DO) D63.4-DIN(DI)
NetD63_2-DOUT: D63.2-DOUT(DO) D64.4-DIN(DI)
NetD64_2-DOUT: D64.2-DOUT(DO) D65.4-DIN(DI)
NetD65_2-DOUT: D65.2-DOUT(DO) D66.4-DIN(DI)
NetD66_2-DOUT: D66.2-DOUT(DO) D67.4-DIN(DI)
NetD67_2-DOUT: D67.2-DOUT(DO) D68.4-DIN(DI)
NetD68_2-DOUT: D68.2-DOUT(DO) D69.4-DIN(DI)
NetD69_2-DOUT: D69.2-DOUT(DO) D70.4-DIN(DI)
NetD70_2-DOUT: D70.2-DOUT(DO) D71.4-DIN(DI)
NetD71_2-DOUT: D71.2-DOUT(DO) D72.4-DIN(DI)
NetD72_2-DOUT: D72.2-DOUT(DO) R5.2
NetD73_2-DOUT: D73.2-DOUT(DO) D74.4-DIN(DI)
NetD73_4-DIN: D73.4-DIN(DI) R5.1
NetD74_2-DOUT: D74.2-DOUT(DO) D75.4-DIN(DI)
NetD75_2-DOUT: D75.2-DOUT(DO) D76.4-DIN(DI)
NetD76_2-DOUT: D76.2-DOUT(DO) D77.4-DIN(DI)
NetD77_2-DOUT: D77.2-DOUT(DO) D78.4-DIN(DI)
NetD78_2-DOUT: D78.2-DOUT(DO) D79.4-DIN(DI)
NetD79_2-DOUT: D79.2-DOUT(DO) D80.4-DIN(DI)
NetD80_2-DOUT: D80.2-DOUT(DO) D81.4-DIN(DI)
NetD81_2-DOUT: D81.2-DOUT(DO) D82.4-DIN(DI)
NetD82_2-DOUT: D82.2-DOUT(DO) D83.4-DIN(DI)
NetD83_2-DOUT: D83.2-DOUT(DO) D84.4-DIN(DI)
NetD84_2-DOUT: D84.2-DOUT(DO) D85.4-DIN(DI)
NetD85_2-DOUT: D85.2-DOUT(DO) D86.4-DIN(DI)
NetD86_2-DOUT: D86.2-DOUT(DO) D87.4-DIN(DI)
NetD87_2-DOUT: D87.2-DOUT(DO) D88.4-DIN(DI)
NetD88_2-DOUT: D88.2-DOUT(DO) D89.4-DIN(DI)
NetD89_2-DOUT: D89.2-DOUT(DO) D90.4-DIN(DI)
NetD90_2-DOUT: D90.2-DOUT(DO) D91.4-DIN(DI)
NetD91_2-DOUT: D91.2-DOUT(DO) D92.4-DIN(DI)
NetD92_2-DOUT: D92.2-DOUT(DO) D93.4-DIN(DI)
NetD93_2-DOUT: D93.2-DOUT(DO) D94.4-DIN(DI)
NetD94_2-DOUT: D94.2-DOUT(DO) D95.4-DIN(DI)
NetD95_2-DOUT: D95.2-DOUT(DO) D96.4-DIN(DI)

### Notes on the sheet
- RGB Rows 3 & 4
- RGB Matrix
- HM

### Library data of the parts
C49-C96 = C0603C104K5RAC7411: as C1 on sheet RGBM-01; Part Number: C0603C104K5RAC7411; Capacitance: 0.1 µF; Applications: Bypass, Decoupling; componentlink1description: Datasheet; componentlink1url: https://api.kemet.com/component-edge/download/datasheet/C0603C104K5RAC7411.pdf; componentlink2description: DigiKey Link; componentlink2url: https://www.digikey.com/en/products/detail/kemet/C0603C104K5RAC7411/3317013; Device Package: 0603 (1608 Metric); lastupdated: 2026-04-06 7:23:52 PM; Lifecycle Status: Active; Minimum Order: 1; Mounting Type: Surface Mount, MLCC; Operating Temperature: -55°C ~ 125°C; Package / Case: 0603 (1608 Metric); packaging: TapeAndReel; partid: 2233; Part Status: Active; price: 0.01; series: SMD Comm X7R; Size / Dimension: 0.063" L x 0.031" W (1.60mm x 0.80mm); Supplier 1: DigiKey; Supplier Part Number 1: 399-C0603C104K5RAC7411CT-ND; Temperature Coefficient: X7R; Thickness (Max): 0.035" (0.90mm); value: 0.1 µF; Voltage - Rated: 50V
D49-D96 = WS2812B: as D1 on sheet RGBM-01; SnapEDA_Link: https://www.snapeda.com/parts/WS2812B/Worldsemi/view-part/?ref=snap; Package: None; MP: WS2812B; Check_prices: https://www.snapeda.com/parts/WS2812B/Worldsemi/view-part/?ref=eda; Value: *
R3-R5 = YJP1608-R001: as R1 on sheet RGBM-01; Part Number: YJP1608-R001; ComponentLink1Description: Datasheet; ComponentLink1URL: http://www.susumu.co.jp/common/pdf/n_catalog_partition10_en.pdf; ComponentLink2Description: DigiKey Link; ComponentLink2URL: https://www.digikey.com/en/products/detail/susumu/YJP1608-R001/2815047; Composition: Thin Film; Device Package: 0603 (1608 Metric); Height - Seated (Max): 0.016" (0.40mm); LastUpdated: 2024-02-09 8:42:50 PM; Lifecycle Status: Active; Minimum Order: 1; Number of Terminations: 2; Operating Temperature: -40°C ~ 125°C; Package / Case: 0603 (1608 Metric); Packaging: TapeAndReel; PartId: 16802; Part Status: Active; Price: 0.08; Resistance: 0 Ohms; Series: YJP; Size / Dimension: 0.063" L x 0.031" W (1.60mm x 0.80mm); Supplier 1: DigiKey; Supplier Part Number 1: 408-1515-1-ND; Supplier Device Package: 0603; Tolerance: Jumper

## Sheet RGBM-03.SchDoc
size Tabloid; SheetNumber: 3; SheetTotal: 7
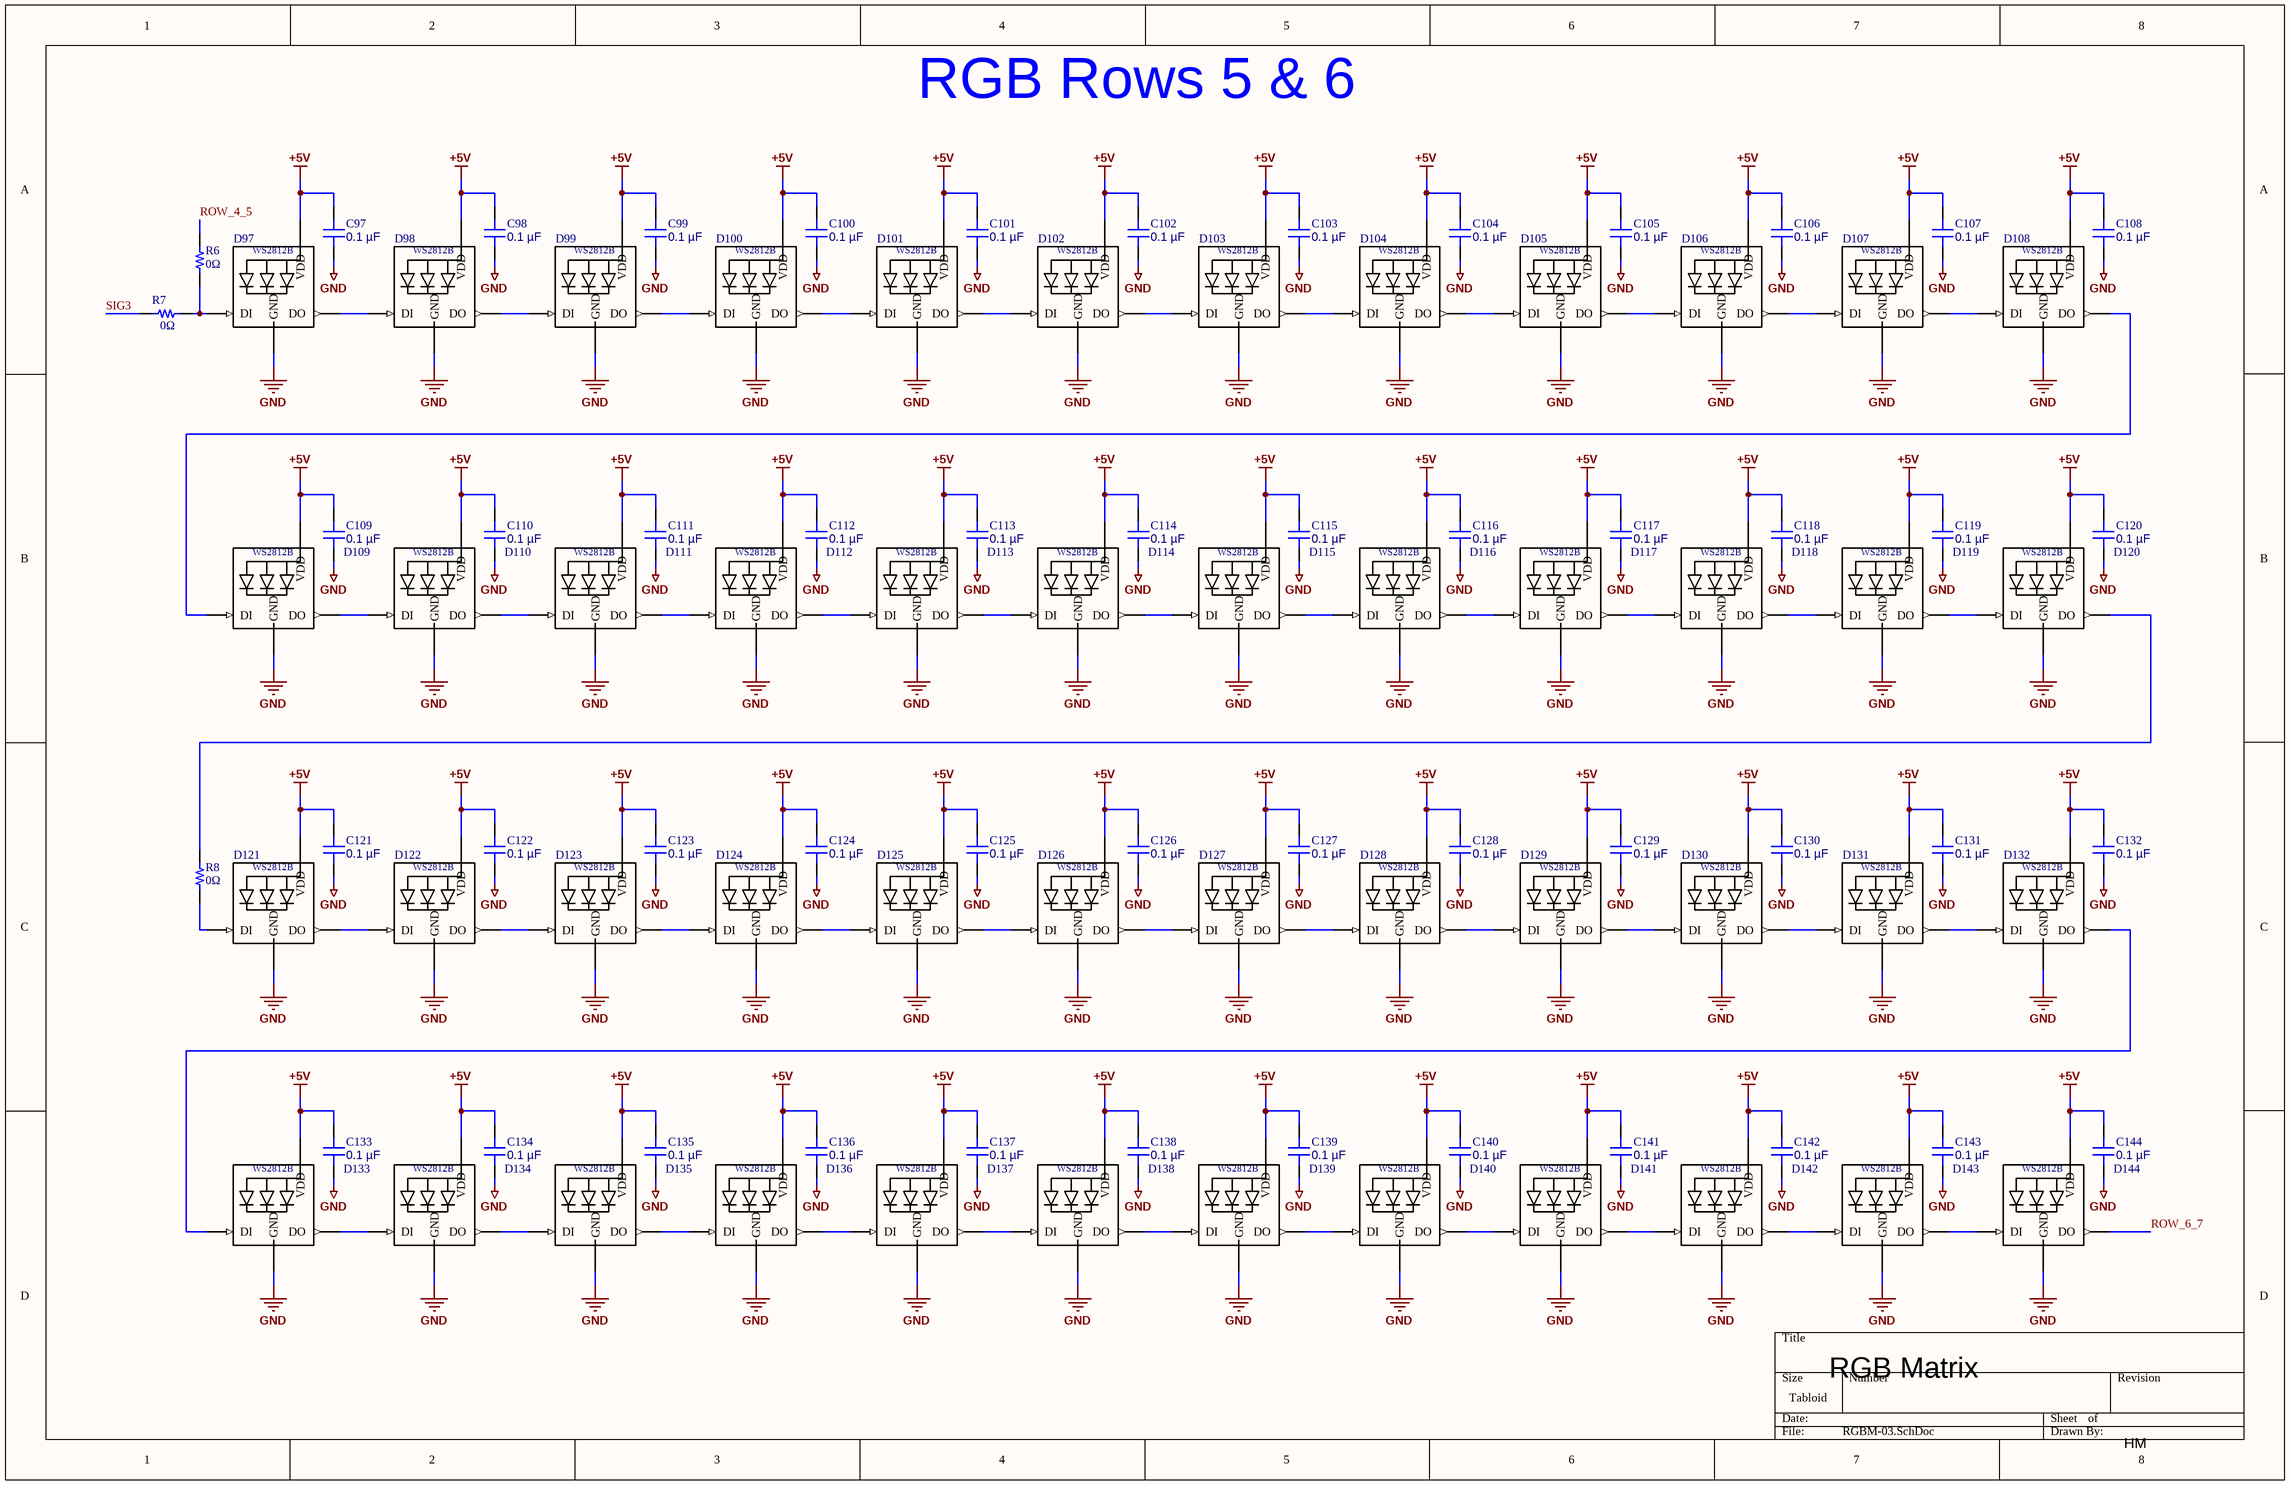
[diagram p2: RGBM-03.SchDoc]

### Parts
C97  0.1 µF  [CAP 0603_1608]
C98  0.1 µF  [CAP 0603_1608]
C99  0.1 µF  [CAP 0603_1608]
C100  0.1 µF  [CAP 0603_1608]
C101  0.1 µF  [CAP 0603_1608]
C102  0.1 µF  [CAP 0603_1608]
C103  0.1 µF  [CAP 0603_1608]
C104  0.1 µF  [CAP 0603_1608]
C105  0.1 µF  [CAP 0603_1608]
C106  0.1 µF  [CAP 0603_1608]
C107  0.1 µF  [CAP 0603_1608]
C108  0.1 µF  [CAP 0603_1608]
C109  0.1 µF  [CAP 0603_1608]
C110  0.1 µF  [CAP 0603_1608]
C111  0.1 µF  [CAP 0603_1608]
C112  0.1 µF  [CAP 0603_1608]
C113  0.1 µF  [CAP 0603_1608]
C114  0.1 µF  [CAP 0603_1608]
C115  0.1 µF  [CAP 0603_1608]
C116  0.1 µF  [CAP 0603_1608]
C117  0.1 µF  [CAP 0603_1608]
C118  0.1 µF  [CAP 0603_1608]
C119  0.1 µF  [CAP 0603_1608]
C120  0.1 µF  [CAP 0603_1608]
C121  0.1 µF  [CAP 0603_1608]
C122  0.1 µF  [CAP 0603_1608]
C123  0.1 µF  [CAP 0603_1608]
C124  0.1 µF  [CAP 0603_1608]
C125  0.1 µF  [CAP 0603_1608]
C126  0.1 µF  [CAP 0603_1608]
C127  0.1 µF  [CAP 0603_1608]
C128  0.1 µF  [CAP 0603_1608]
C129  0.1 µF  [CAP 0603_1608]
C130  0.1 µF  [CAP 0603_1608]
C131  0.1 µF  [CAP 0603_1608]
C132  0.1 µF  [CAP 0603_1608]
C133  0.1 µF  [CAP 0603_1608]
C134  0.1 µF  [CAP 0603_1608]
C135  0.1 µF  [CAP 0603_1608]
C136  0.1 µF  [CAP 0603_1608]
C137  0.1 µF  [CAP 0603_1608]
C138  0.1 µF  [CAP 0603_1608]
C139  0.1 µF  [CAP 0603_1608]
C140  0.1 µF  [CAP 0603_1608]
C141  0.1 µF  [CAP 0603_1608]
C142  0.1 µF  [CAP 0603_1608]
C143  0.1 µF  [CAP 0603_1608]
C144  0.1 µF  [CAP 0603_1608]
D97  WS2812B  [*WS2812B_WS2812B(Primary)]  (value not drawn)
D98  WS2812B  [*WS2812B_WS2812B(Primary)]  (value not drawn)
D99  WS2812B  [*WS2812B_WS2812B(Primary)]  (value not drawn)
D100  WS2812B  [*WS2812B_WS2812B(Primary)]  (value not drawn)
D101  WS2812B  [*WS2812B_WS2812B(Primary)]  (value not drawn)
D102  WS2812B  [*WS2812B_WS2812B(Primary)]  (value not drawn)
D103  WS2812B  [*WS2812B_WS2812B(Primary)]  (value not drawn)
D104  WS2812B  [*WS2812B_WS2812B(Primary)]  (value not drawn)
D105  WS2812B  [*WS2812B_WS2812B(Primary)]  (value not drawn)
D106  WS2812B  [*WS2812B_WS2812B(Primary)]  (value not drawn)
D107  WS2812B  [*WS2812B_WS2812B(Primary)]  (value not drawn)
D108  WS2812B  [*WS2812B_WS2812B(Primary)]  (value not drawn)
D109  WS2812B  [*WS2812B_WS2812B(Primary)]  (value not drawn)
D110  WS2812B  [*WS2812B_WS2812B(Primary)]  (value not drawn)
D111  WS2812B  [*WS2812B_WS2812B(Primary)]  (value not drawn)
D112  WS2812B  [*WS2812B_WS2812B(Primary)]  (value not drawn)
D113  WS2812B  [*WS2812B_WS2812B(Primary)]  (value not drawn)
D114  WS2812B  [*WS2812B_WS2812B(Primary)]  (value not drawn)
D115  WS2812B  [*WS2812B_WS2812B(Primary)]  (value not drawn)
D116  WS2812B  [*WS2812B_WS2812B(Primary)]  (value not drawn)
D117  WS2812B  [*WS2812B_WS2812B(Primary)]  (value not drawn)
D118  WS2812B  [*WS2812B_WS2812B(Primary)]  (value not drawn)
D119  WS2812B  [*WS2812B_WS2812B(Primary)]  (value not drawn)
D120  WS2812B  [*WS2812B_WS2812B(Primary)]  (value not drawn)
D121  WS2812B  [*WS2812B_WS2812B(Primary)]  (value not drawn)
D122  WS2812B  [*WS2812B_WS2812B(Primary)]  (value not drawn)
D123  WS2812B  [*WS2812B_WS2812B(Primary)]  (value not drawn)
D124  WS2812B  [*WS2812B_WS2812B(Primary)]  (value not drawn)
D125  WS2812B  [*WS2812B_WS2812B(Primary)]  (value not drawn)
D126  WS2812B  [*WS2812B_WS2812B(Primary)]  (value not drawn)
D127  WS2812B  [*WS2812B_WS2812B(Primary)]  (value not drawn)
D128  WS2812B  [*WS2812B_WS2812B(Primary)]  (value not drawn)
D129  WS2812B  [*WS2812B_WS2812B(Primary)]  (value not drawn)
D130  WS2812B  [*WS2812B_WS2812B(Primary)]  (value not drawn)
D131  WS2812B  [*WS2812B_WS2812B(Primary)]  (value not drawn)
D132  WS2812B  [*WS2812B_WS2812B(Primary)]  (value not drawn)
D133  WS2812B  [*WS2812B_WS2812B(Primary)]  (value not drawn)
D134  WS2812B  [*WS2812B_WS2812B(Primary)]  (value not drawn)
D135  WS2812B  [*WS2812B_WS2812B(Primary)]  (value not drawn)
D136  WS2812B  [*WS2812B_WS2812B(Primary)]  (value not drawn)
D137  WS2812B  [*WS2812B_WS2812B(Primary)]  (value not drawn)
D138  WS2812B  [*WS2812B_WS2812B(Primary)]  (value not drawn)
D139  WS2812B  [*WS2812B_WS2812B(Primary)]  (value not drawn)
D140  WS2812B  [*WS2812B_WS2812B(Primary)]  (value not drawn)
D141  WS2812B  [*WS2812B_WS2812B(Primary)]  (value not drawn)
D142  WS2812B  [*WS2812B_WS2812B(Primary)]  (value not drawn)
D143  WS2812B  [*WS2812B_WS2812B(Primary)]  (value not drawn)
D144  WS2812B  [*WS2812B_WS2812B(Primary)]  (value not drawn)
R6  0Ω  [RES 0603_1608]
R7  0Ω  [RES 0603_1608]
R8  0Ω  [RES 0603_1608]

### Nets
+5V: C97.2 C98.2 C99.2 C100.2 C101.2 C102.2 C103.2 C104.2 C105.2 C106.2 C107.2 C108.2 C109.2 C110.2 C111.2 C112.2 C113.2 C114.2 C115.2 C116.2 C117.2 C118.2 C119.2 C120.2 C121.2 C122.2 C123.2 C124.2 C125.2 C126.2 C127.2 C128.2 C129.2 C130.2 C131.2 C132.2 C133.2 C134.2 C135.2 C136.2 C137.2 C138.2 C139.2 C140.2 C141.2 C142.2 C143.2 C144.2 D97.1-VDD(VDD) D98.1-VDD(VDD) D99.1-VDD(VDD) D100.1-VDD(VDD) D101.1-VDD(VDD) D102.1-VDD(VDD) D103.1-VDD(VDD) D104.1-VDD(VDD) D105.1-VDD(VDD) D106.1-VDD(VDD) D107.1-VDD(VDD) D108.1-VDD(VDD) D109.1-VDD(VDD) D110.1-VDD(VDD) D111.1-VDD(VDD) D112.1-VDD(VDD) D113.1-VDD(VDD) D114.1-VDD(VDD) D115.1-VDD(VDD) D116.1-VDD(VDD) D117.1-VDD(VDD) D118.1-VDD(VDD) D119.1-VDD(VDD) D120.1-VDD(VDD) D121.1-VDD(VDD) D122.1-VDD(VDD) D123.1-VDD(VDD) D124.1-VDD(VDD) D125.1-VDD(VDD) D126.1-VDD(VDD) D127.1-VDD(VDD) D128.1-VDD(VDD) D129.1-VDD(VDD) D130.1-VDD(VDD) D131.1-VDD(VDD) D132.1-VDD(VDD) D133.1-VDD(VDD) D134.1-VDD(VDD) D135.1-VDD(VDD) D136.1-VDD(VDD) D137.1-VDD(VDD) D138.1-VDD(VDD) D139.1-VDD(VDD) D140.1-VDD(VDD) D141.1-VDD(VDD) D142.1-VDD(VDD) D143.1-VDD(VDD) D144.1-VDD(VDD)
GND: C97.1 C98.1 C99.1 C100.1 C101.1 C102.1 C103.1 C104.1 C105.1 C106.1 C107.1 C108.1 C109.1 C110.1 C111.1 C112.1 C113.1 C114.1 C115.1 C116.1 C117.1 C118.1 C119.1 C120.1 C121.1 C122.1 C123.1 C124.1 C125.1 C126.1 C127.1 C128.1 C129.1 C130.1 C131.1 C132.1 C133.1 C134.1 C135.1 C136.1 C137.1 C138.1 C139.1 C140.1 C141.1 C142.1 C143.1 C144.1 D97.3-GND(GND) D98.3-GND(GND) D99.3-GND(GND) D100.3-GND(GND) D101.3-GND(GND) D102.3-GND(GND) D103.3-GND(GND) D104.3-GND(GND) D105.3-GND(GND) D106.3-GND(GND) D107.3-GND(GND) D108.3-GND(GND) D109.3-GND(GND) D110.3-GND(GND) D111.3-GND(GND) D112.3-GND(GND) D113.3-GND(GND) D114.3-GND(GND) D115.3-GND(GND) D116.3-GND(GND) D117.3-GND(GND) D118.3-GND(GND) D119.3-GND(GND) D120.3-GND(GND) D121.3-GND(GND) D122.3-GND(GND) D123.3-GND(GND) D124.3-GND(GND) D125.3-GND(GND) D126.3-GND(GND) D127.3-GND(GND) D128.3-GND(GND) D129.3-GND(GND) D130.3-GND(GND) D131.3-GND(GND) D132.3-GND(GND) D133.3-GND(GND) D134.3-GND(GND) D135.3-GND(GND) D136.3-GND(GND) D137.3-GND(GND) D138.3-GND(GND) D139.3-GND(GND) D140.3-GND(GND) D141.3-GND(GND) D142.3-GND(GND) D143.3-GND(GND) D144.3-GND(GND)
ROW_4_5: R6.2
ROW_6_7: D144.2-DOUT(DO)
SIG3: R7.1
NetD97_2-DOUT: D97.2-DOUT(DO) D98.4-DIN(DI)
NetD97_4-DIN: D97.4-DIN(DI) R6.1 R7.2
NetD98_2-DOUT: D98.2-DOUT(DO) D99.4-DIN(DI)
NetD99_2-DOUT: D99.2-DOUT(DO) D100.4-DIN(DI)
NetD100_2-DOUT: D100.2-DOUT(DO) D101.4-DIN(DI)
NetD101_2-DOUT: D101.2-DOUT(DO) D102.4-DIN(DI)
NetD102_2-DOUT: D102.2-DOUT(DO) D103.4-DIN(DI)
NetD103_2-DOUT: D103.2-DOUT(DO) D104.4-DIN(DI)
NetD104_2-DOUT: D104.2-DOUT(DO) D105.4-DIN(DI)
NetD105_2-DOUT: D105.2-DOUT(DO) D106.4-DIN(DI)
NetD106_2-DOUT: D106.2-DOUT(DO) D107.4-DIN(DI)
NetD107_2-DOUT: D107.2-DOUT(DO) D108.4-DIN(DI)
NetD108_2-DOUT: D108.2-DOUT(DO) D109.4-DIN(DI)
NetD109_2-DOUT: D109.2-DOUT(DO) D110.4-DIN(DI)
NetD110_2-DOUT: D110.2-DOUT(DO) D111.4-DIN(DI)
NetD111_2-DOUT: D111.2-DOUT(DO) D112.4-DIN(DI)
NetD112_2-DOUT: D112.2-DOUT(DO) D113.4-DIN(DI)
NetD113_2-DOUT: D113.2-DOUT(DO) D114.4-DIN(DI)
NetD114_2-DOUT: D114.2-DOUT(DO) D115.4-DIN(DI)
NetD115_2-DOUT: D115.2-DOUT(DO) D116.4-DIN(DI)
NetD116_2-DOUT: D116.2-DOUT(DO) D117.4-DIN(DI)
NetD117_2-DOUT: D117.2-DOUT(DO) D118.4-DIN(DI)
NetD118_2-DOUT: D118.2-DOUT(DO) D119.4-DIN(DI)
NetD119_2-DOUT: D119.2-DOUT(DO) D120.4-DIN(DI)
NetD120_2-DOUT: D120.2-DOUT(DO) R8.2
NetD121_2-DOUT: D121.2-DOUT(DO) D122.4-DIN(DI)
NetD121_4-DIN: D121.4-DIN(DI) R8.1
NetD122_2-DOUT: D122.2-DOUT(DO) D123.4-DIN(DI)
NetD123_2-DOUT: D123.2-DOUT(DO) D124.4-DIN(DI)
NetD124_2-DOUT: D124.2-DOUT(DO) D125.4-DIN(DI)
NetD125_2-DOUT: D125.2-DOUT(DO) D126.4-DIN(DI)
NetD126_2-DOUT: D126.2-DOUT(DO) D127.4-DIN(DI)
NetD127_2-DOUT: D127.2-DOUT(DO) D128.4-DIN(DI)
NetD128_2-DOUT: D128.2-DOUT(DO) D129.4-DIN(DI)
NetD129_2-DOUT: D129.2-DOUT(DO) D130.4-DIN(DI)
NetD130_2-DOUT: D130.2-DOUT(DO) D131.4-DIN(DI)
NetD131_2-DOUT: D131.2-DOUT(DO) D132.4-DIN(DI)
NetD132_2-DOUT: D132.2-DOUT(DO) D133.4-DIN(DI)
NetD133_2-DOUT: D133.2-DOUT(DO) D134.4-DIN(DI)
NetD134_2-DOUT: D134.2-DOUT(DO) D135.4-DIN(DI)
NetD135_2-DOUT: D135.2-DOUT(DO) D136.4-DIN(DI)
NetD136_2-DOUT: D136.2-DOUT(DO) D137.4-DIN(DI)
NetD137_2-DOUT: D137.2-DOUT(DO) D138.4-DIN(DI)
NetD138_2-DOUT: D138.2-DOUT(DO) D139.4-DIN(DI)
NetD139_2-DOUT: D139.2-DOUT(DO) D140.4-DIN(DI)
NetD140_2-DOUT: D140.2-DOUT(DO) D141.4-DIN(DI)
NetD141_2-DOUT: D141.2-DOUT(DO) D142.4-DIN(DI)
NetD142_2-DOUT: D142.2-DOUT(DO) D143.4-DIN(DI)
NetD143_2-DOUT: D143.2-DOUT(DO) D144.4-DIN(DI)

### Notes on the sheet
- RGB Rows 5 & 6
- RGB Matrix
- HM

### Library data of the parts
C97-C144 = C0603C104K5RAC7411: as C1 on sheet RGBM-01; Part Number: C0603C104K5RAC7411; Capacitance: 0.1 µF; Applications: Bypass, Decoupling; componentlink1description: Datasheet; componentlink1url: https://api.kemet.com/component-edge/download/datasheet/C0603C104K5RAC7411.pdf; componentlink2description: DigiKey Link; componentlink2url: https://www.digikey.com/en/products/detail/kemet/C0603C104K5RAC7411/3317013; Device Package: 0603 (1608 Metric); lastupdated: 2026-04-06 7:23:52 PM; Lifecycle Status: Active; Minimum Order: 1; Mounting Type: Surface Mount, MLCC; Operating Temperature: -55°C ~ 125°C; Package / Case: 0603 (1608 Metric); packaging: TapeAndReel; partid: 2233; Part Status: Active; price: 0.01; series: SMD Comm X7R; Size / Dimension: 0.063" L x 0.031" W (1.60mm x 0.80mm); Supplier 1: DigiKey; Supplier Part Number 1: 399-C0603C104K5RAC7411CT-ND; Temperature Coefficient: X7R; Thickness (Max): 0.035" (0.90mm); value: 0.1 µF; Voltage - Rated: 50V
D97-D144 = WS2812B: as D1 on sheet RGBM-01; SnapEDA_Link: https://www.snapeda.com/parts/WS2812B/Worldsemi/view-part/?ref=snap; Package: None; MP: WS2812B; Check_prices: https://www.snapeda.com/parts/WS2812B/Worldsemi/view-part/?ref=eda; Value: *
R6-R8 = YJP1608-R001: as R1 on sheet RGBM-01; Part Number: YJP1608-R001; ComponentLink1Description: Datasheet; ComponentLink1URL: http://www.susumu.co.jp/common/pdf/n_catalog_partition10_en.pdf; ComponentLink2Description: DigiKey Link; ComponentLink2URL: https://www.digikey.com/en/products/detail/susumu/YJP1608-R001/2815047; Composition: Thin Film; Device Package: 0603 (1608 Metric); Height - Seated (Max): 0.016" (0.40mm); LastUpdated: 2024-02-09 8:42:50 PM; Lifecycle Status: Active; Minimum Order: 1; Number of Terminations: 2; Operating Temperature: -40°C ~ 125°C; Package / Case: 0603 (1608 Metric); Packaging: TapeAndReel; PartId: 16802; Part Status: Active; Price: 0.08; Resistance: 0 Ohms; Series: YJP; Size / Dimension: 0.063" L x 0.031" W (1.60mm x 0.80mm); Supplier 1: DigiKey; Supplier Part Number 1: 408-1515-1-ND; Supplier Device Package: 0603; Tolerance: Jumper

## Sheet RGBM-04.SchDoc
size Tabloid; SheetNumber: 4; SheetTotal: 7
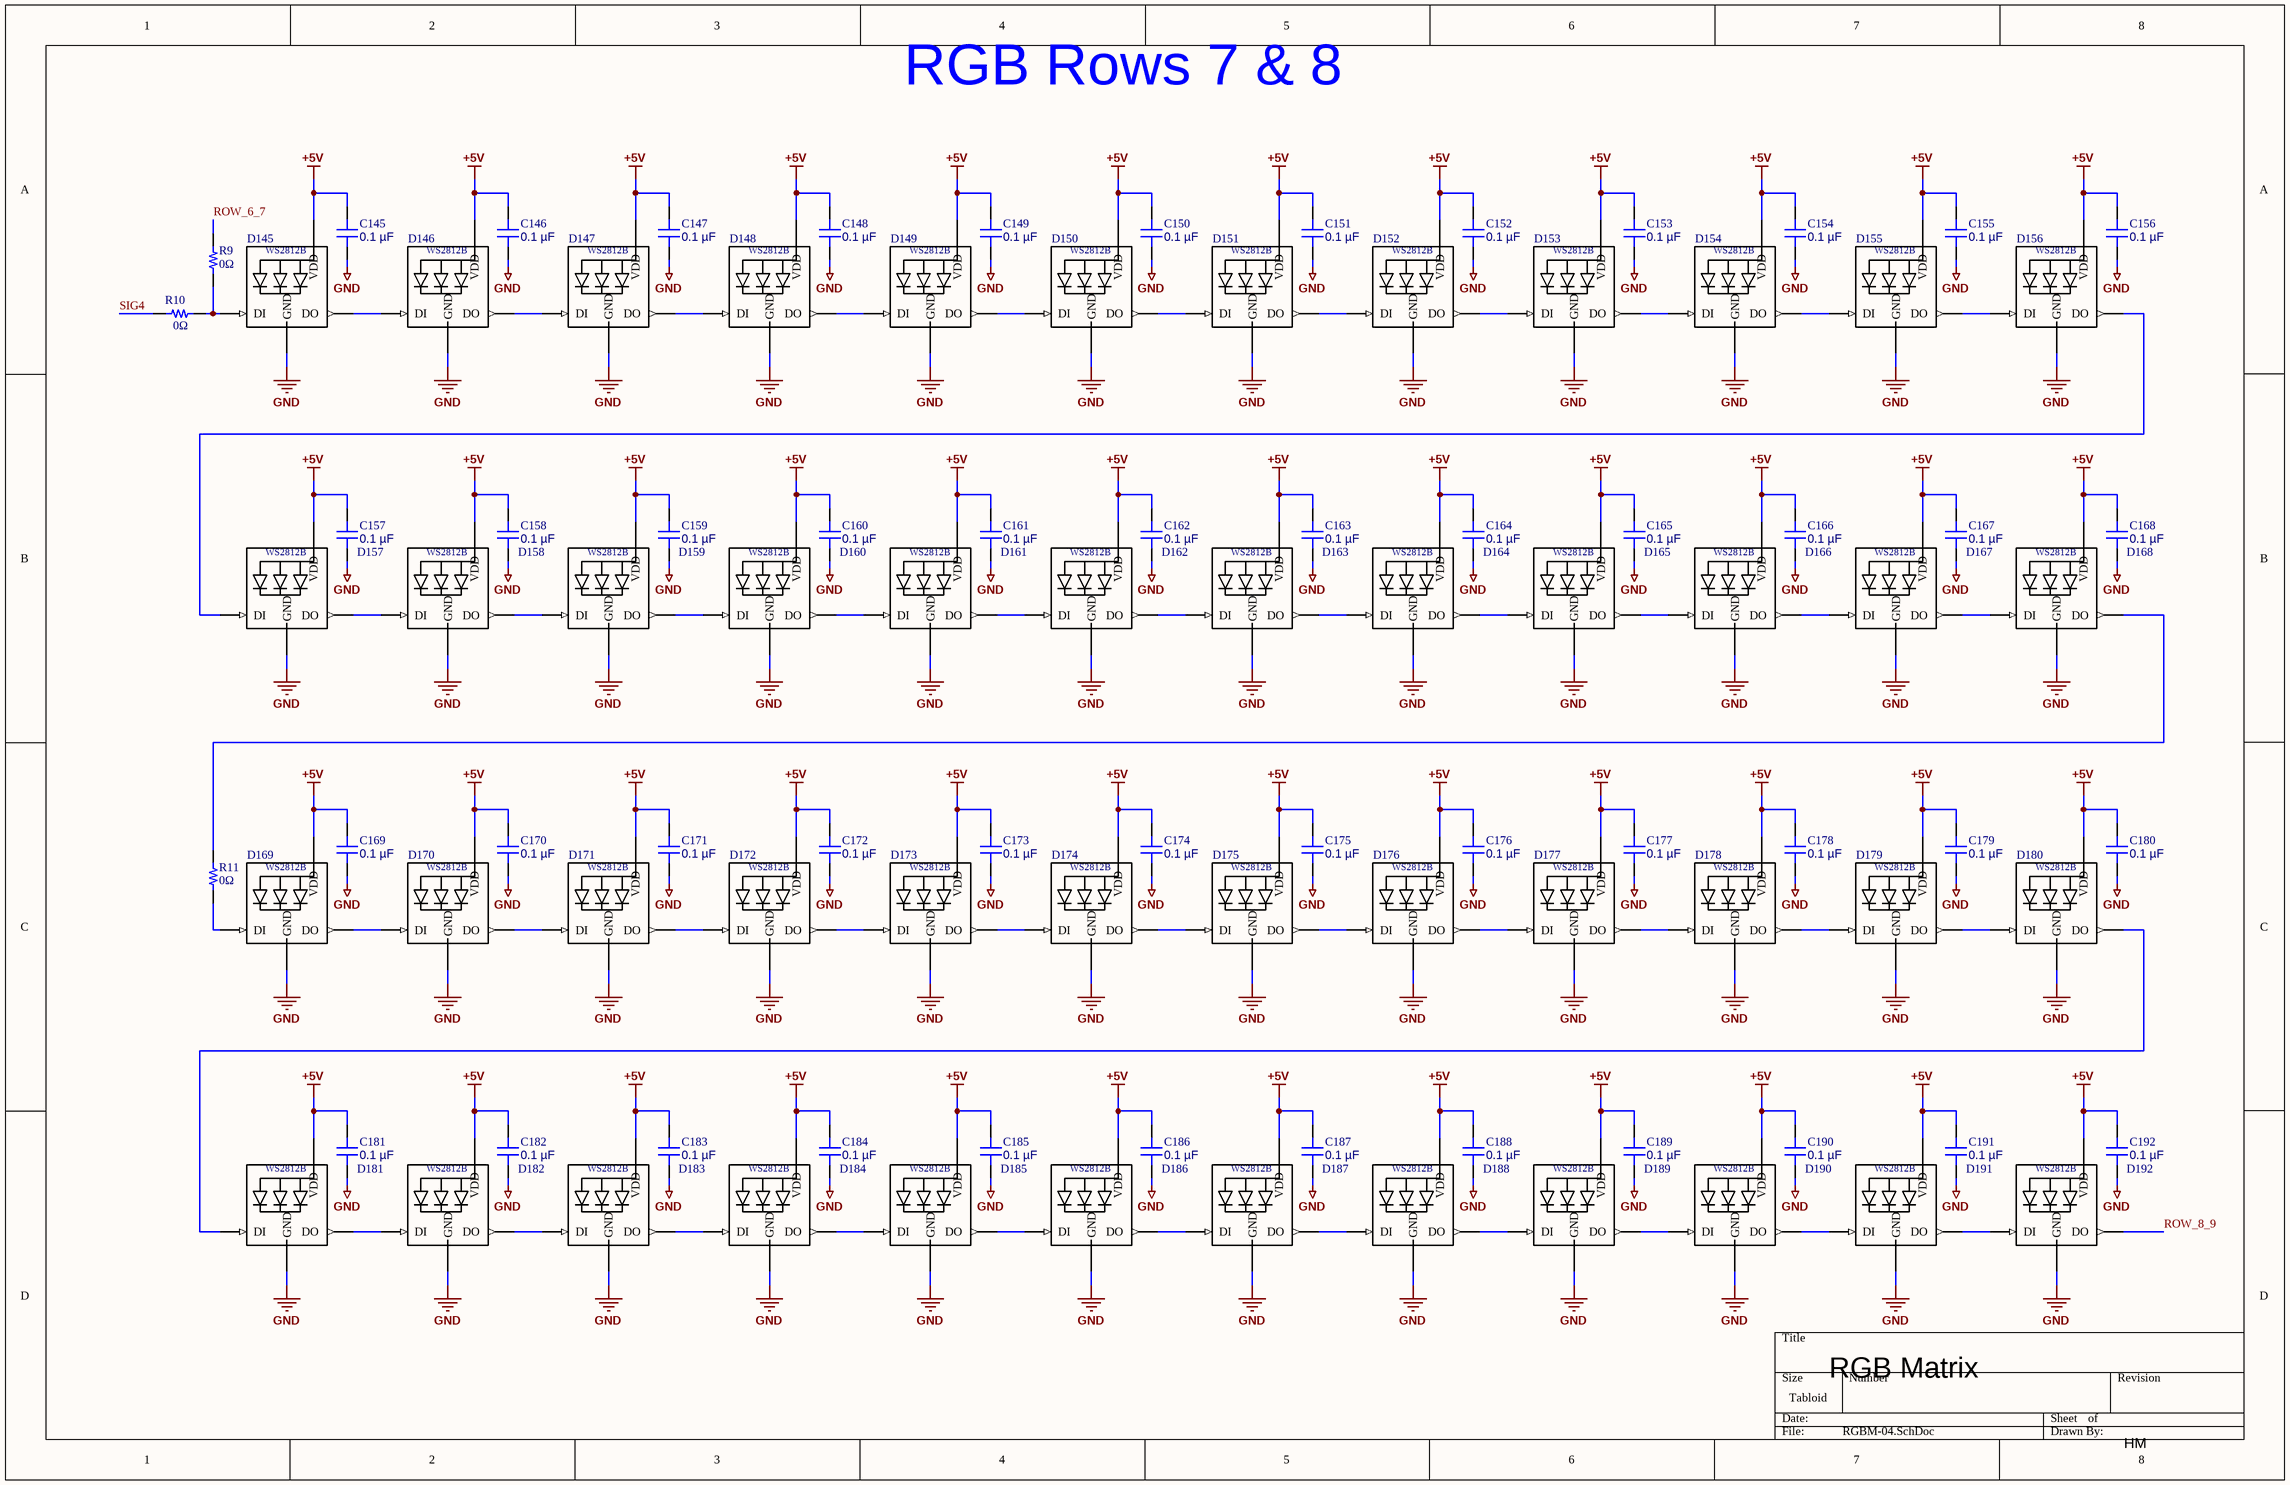
[diagram p3: RGBM-04.SchDoc]

### Parts
C145  0.1 µF  [CAP 0603_1608]
C146  0.1 µF  [CAP 0603_1608]
C147  0.1 µF  [CAP 0603_1608]
C148  0.1 µF  [CAP 0603_1608]
C149  0.1 µF  [CAP 0603_1608]
C150  0.1 µF  [CAP 0603_1608]
C151  0.1 µF  [CAP 0603_1608]
C152  0.1 µF  [CAP 0603_1608]
C153  0.1 µF  [CAP 0603_1608]
C154  0.1 µF  [CAP 0603_1608]
C155  0.1 µF  [CAP 0603_1608]
C156  0.1 µF  [CAP 0603_1608]
C157  0.1 µF  [CAP 0603_1608]
C158  0.1 µF  [CAP 0603_1608]
C159  0.1 µF  [CAP 0603_1608]
C160  0.1 µF  [CAP 0603_1608]
C161  0.1 µF  [CAP 0603_1608]
C162  0.1 µF  [CAP 0603_1608]
C163  0.1 µF  [CAP 0603_1608]
C164  0.1 µF  [CAP 0603_1608]
C165  0.1 µF  [CAP 0603_1608]
C166  0.1 µF  [CAP 0603_1608]
C167  0.1 µF  [CAP 0603_1608]
C168  0.1 µF  [CAP 0603_1608]
C169  0.1 µF  [CAP 0603_1608]
C170  0.1 µF  [CAP 0603_1608]
C171  0.1 µF  [CAP 0603_1608]
C172  0.1 µF  [CAP 0603_1608]
C173  0.1 µF  [CAP 0603_1608]
C174  0.1 µF  [CAP 0603_1608]
C175  0.1 µF  [CAP 0603_1608]
C176  0.1 µF  [CAP 0603_1608]
C177  0.1 µF  [CAP 0603_1608]
C178  0.1 µF  [CAP 0603_1608]
C179  0.1 µF  [CAP 0603_1608]
C180  0.1 µF  [CAP 0603_1608]
C181  0.1 µF  [CAP 0603_1608]
C182  0.1 µF  [CAP 0603_1608]
C183  0.1 µF  [CAP 0603_1608]
C184  0.1 µF  [CAP 0603_1608]
C185  0.1 µF  [CAP 0603_1608]
C186  0.1 µF  [CAP 0603_1608]
C187  0.1 µF  [CAP 0603_1608]
C188  0.1 µF  [CAP 0603_1608]
C189  0.1 µF  [CAP 0603_1608]
C190  0.1 µF  [CAP 0603_1608]
C191  0.1 µF  [CAP 0603_1608]
C192  0.1 µF  [CAP 0603_1608]
D145  WS2812B  [*WS2812B_WS2812B(Primary)]  (value not drawn)
D146  WS2812B  [*WS2812B_WS2812B(Primary)]  (value not drawn)
D147  WS2812B  [*WS2812B_WS2812B(Primary)]  (value not drawn)
D148  WS2812B  [*WS2812B_WS2812B(Primary)]  (value not drawn)
D149  WS2812B  [*WS2812B_WS2812B(Primary)]  (value not drawn)
D150  WS2812B  [*WS2812B_WS2812B(Primary)]  (value not drawn)
D151  WS2812B  [*WS2812B_WS2812B(Primary)]  (value not drawn)
D152  WS2812B  [*WS2812B_WS2812B(Primary)]  (value not drawn)
D153  WS2812B  [*WS2812B_WS2812B(Primary)]  (value not drawn)
D154  WS2812B  [*WS2812B_WS2812B(Primary)]  (value not drawn)
D155  WS2812B  [*WS2812B_WS2812B(Primary)]  (value not drawn)
D156  WS2812B  [*WS2812B_WS2812B(Primary)]  (value not drawn)
D157  WS2812B  [*WS2812B_WS2812B(Primary)]  (value not drawn)
D158  WS2812B  [*WS2812B_WS2812B(Primary)]  (value not drawn)
D159  WS2812B  [*WS2812B_WS2812B(Primary)]  (value not drawn)
D160  WS2812B  [*WS2812B_WS2812B(Primary)]  (value not drawn)
D161  WS2812B  [*WS2812B_WS2812B(Primary)]  (value not drawn)
D162  WS2812B  [*WS2812B_WS2812B(Primary)]  (value not drawn)
D163  WS2812B  [*WS2812B_WS2812B(Primary)]  (value not drawn)
D164  WS2812B  [*WS2812B_WS2812B(Primary)]  (value not drawn)
D165  WS2812B  [*WS2812B_WS2812B(Primary)]  (value not drawn)
D166  WS2812B  [*WS2812B_WS2812B(Primary)]  (value not drawn)
D167  WS2812B  [*WS2812B_WS2812B(Primary)]  (value not drawn)
D168  WS2812B  [*WS2812B_WS2812B(Primary)]  (value not drawn)
D169  WS2812B  [*WS2812B_WS2812B(Primary)]  (value not drawn)
D170  WS2812B  [*WS2812B_WS2812B(Primary)]  (value not drawn)
D171  WS2812B  [*WS2812B_WS2812B(Primary)]  (value not drawn)
D172  WS2812B  [*WS2812B_WS2812B(Primary)]  (value not drawn)
D173  WS2812B  [*WS2812B_WS2812B(Primary)]  (value not drawn)
D174  WS2812B  [*WS2812B_WS2812B(Primary)]  (value not drawn)
D175  WS2812B  [*WS2812B_WS2812B(Primary)]  (value not drawn)
D176  WS2812B  [*WS2812B_WS2812B(Primary)]  (value not drawn)
D177  WS2812B  [*WS2812B_WS2812B(Primary)]  (value not drawn)
D178  WS2812B  [*WS2812B_WS2812B(Primary)]  (value not drawn)
D179  WS2812B  [*WS2812B_WS2812B(Primary)]  (value not drawn)
D180  WS2812B  [*WS2812B_WS2812B(Primary)]  (value not drawn)
D181  WS2812B  [*WS2812B_WS2812B(Primary)]  (value not drawn)
D182  WS2812B  [*WS2812B_WS2812B(Primary)]  (value not drawn)
D183  WS2812B  [*WS2812B_WS2812B(Primary)]  (value not drawn)
D184  WS2812B  [*WS2812B_WS2812B(Primary)]  (value not drawn)
D185  WS2812B  [*WS2812B_WS2812B(Primary)]  (value not drawn)
D186  WS2812B  [*WS2812B_WS2812B(Primary)]  (value not drawn)
D187  WS2812B  [*WS2812B_WS2812B(Primary)]  (value not drawn)
D188  WS2812B  [*WS2812B_WS2812B(Primary)]  (value not drawn)
D189  WS2812B  [*WS2812B_WS2812B(Primary)]  (value not drawn)
D190  WS2812B  [*WS2812B_WS2812B(Primary)]  (value not drawn)
D191  WS2812B  [*WS2812B_WS2812B(Primary)]  (value not drawn)
D192  WS2812B  [*WS2812B_WS2812B(Primary)]  (value not drawn)
R9  0Ω  [RES 0603_1608]
R10  0Ω  [RES 0603_1608]
R11  0Ω  [RES 0603_1608]

### Nets
+5V: C145.2 C146.2 C147.2 C148.2 C149.2 C150.2 C151.2 C152.2 C153.2 C154.2 C155.2 C156.2 C157.2 C158.2 C159.2 C160.2 C161.2 C162.2 C163.2 C164.2 C165.2 C166.2 C167.2 C168.2 C169.2 C170.2 C171.2 C172.2 C173.2 C174.2 C175.2 C176.2 C177.2 C178.2 C179.2 C180.2 C181.2 C182.2 C183.2 C184.2 C185.2 C186.2 C187.2 C188.2 C189.2 C190.2 C191.2 C192.2 D145.1-VDD(VDD) D146.1-VDD(VDD) D147.1-VDD(VDD) D148.1-VDD(VDD) D149.1-VDD(VDD) D150.1-VDD(VDD) D151.1-VDD(VDD) D152.1-VDD(VDD) D153.1-VDD(VDD) D154.1-VDD(VDD) D155.1-VDD(VDD) D156.1-VDD(VDD) D157.1-VDD(VDD) D158.1-VDD(VDD) D159.1-VDD(VDD) D160.1-VDD(VDD) D161.1-VDD(VDD) D162.1-VDD(VDD) D163.1-VDD(VDD) D164.1-VDD(VDD) D165.1-VDD(VDD) D166.1-VDD(VDD) D167.1-VDD(VDD) D168.1-VDD(VDD) D169.1-VDD(VDD) D170.1-VDD(VDD) D171.1-VDD(VDD) D172.1-VDD(VDD) D173.1-VDD(VDD) D174.1-VDD(VDD) D175.1-VDD(VDD) D176.1-VDD(VDD) D177.1-VDD(VDD) D178.1-VDD(VDD) D179.1-VDD(VDD) D180.1-VDD(VDD) D181.1-VDD(VDD) D182.1-VDD(VDD) D183.1-VDD(VDD) D184.1-VDD(VDD) D185.1-VDD(VDD) D186.1-VDD(VDD) D187.1-VDD(VDD) D188.1-VDD(VDD) D189.1-VDD(VDD) D190.1-VDD(VDD) D191.1-VDD(VDD) D192.1-VDD(VDD)
GND: C145.1 C146.1 C147.1 C148.1 C149.1 C150.1 C151.1 C152.1 C153.1 C154.1 C155.1 C156.1 C157.1 C158.1 C159.1 C160.1 C161.1 C162.1 C163.1 C164.1 C165.1 C166.1 C167.1 C168.1 C169.1 C170.1 C171.1 C172.1 C173.1 C174.1 C175.1 C176.1 C177.1 C178.1 C179.1 C180.1 C181.1 C182.1 C183.1 C184.1 C185.1 C186.1 C187.1 C188.1 C189.1 C190.1 C191.1 C192.1 D145.3-GND(GND) D146.3-GND(GND) D147.3-GND(GND) D148.3-GND(GND) D149.3-GND(GND) D150.3-GND(GND) D151.3-GND(GND) D152.3-GND(GND) D153.3-GND(GND) D154.3-GND(GND) D155.3-GND(GND) D156.3-GND(GND) D157.3-GND(GND) D158.3-GND(GND) D159.3-GND(GND) D160.3-GND(GND) D161.3-GND(GND) D162.3-GND(GND) D163.3-GND(GND) D164.3-GND(GND) D165.3-GND(GND) D166.3-GND(GND) D167.3-GND(GND) D168.3-GND(GND) D169.3-GND(GND) D170.3-GND(GND) D171.3-GND(GND) D172.3-GND(GND) D173.3-GND(GND) D174.3-GND(GND) D175.3-GND(GND) D176.3-GND(GND) D177.3-GND(GND) D178.3-GND(GND) D179.3-GND(GND) D180.3-GND(GND) D181.3-GND(GND) D182.3-GND(GND) D183.3-GND(GND) D184.3-GND(GND) D185.3-GND(GND) D186.3-GND(GND) D187.3-GND(GND) D188.3-GND(GND) D189.3-GND(GND) D190.3-GND(GND) D191.3-GND(GND) D192.3-GND(GND)
ROW_6_7: R9.2
ROW_8_9: D192.2-DOUT(DO)
SIG4: R10.1
NetD145_2-DOUT: D145.2-DOUT(DO) D146.4-DIN(DI)
NetD145_4-DIN: D145.4-DIN(DI) R9.1 R10.2
NetD146_2-DOUT: D146.2-DOUT(DO) D147.4-DIN(DI)
NetD147_2-DOUT: D147.2-DOUT(DO) D148.4-DIN(DI)
NetD148_2-DOUT: D148.2-DOUT(DO) D149.4-DIN(DI)
NetD149_2-DOUT: D149.2-DOUT(DO) D150.4-DIN(DI)
NetD150_2-DOUT: D150.2-DOUT(DO) D151.4-DIN(DI)
NetD151_2-DOUT: D151.2-DOUT(DO) D152.4-DIN(DI)
NetD152_2-DOUT: D152.2-DOUT(DO) D153.4-DIN(DI)
NetD153_2-DOUT: D153.2-DOUT(DO) D154.4-DIN(DI)
NetD154_2-DOUT: D154.2-DOUT(DO) D155.4-DIN(DI)
NetD155_2-DOUT: D155.2-DOUT(DO) D156.4-DIN(DI)
NetD156_2-DOUT: D156.2-DOUT(DO) D157.4-DIN(DI)
NetD157_2-DOUT: D157.2-DOUT(DO) D158.4-DIN(DI)
NetD158_2-DOUT: D158.2-DOUT(DO) D159.4-DIN(DI)
NetD159_2-DOUT: D159.2-DOUT(DO) D160.4-DIN(DI)
NetD160_2-DOUT: D160.2-DOUT(DO) D161.4-DIN(DI)
NetD161_2-DOUT: D161.2-DOUT(DO) D162.4-DIN(DI)
NetD162_2-DOUT: D162.2-DOUT(DO) D163.4-DIN(DI)
NetD163_2-DOUT: D163.2-DOUT(DO) D164.4-DIN(DI)
NetD164_2-DOUT: D164.2-DOUT(DO) D165.4-DIN(DI)
NetD165_2-DOUT: D165.2-DOUT(DO) D166.4-DIN(DI)
NetD166_2-DOUT: D166.2-DOUT(DO) D167.4-DIN(DI)
NetD167_2-DOUT: D167.2-DOUT(DO) D168.4-DIN(DI)
NetD168_2-DOUT: D168.2-DOUT(DO) R11.2
NetD169_2-DOUT: D169.2-DOUT(DO) D170.4-DIN(DI)
NetD169_4-DIN: D169.4-DIN(DI) R11.1
NetD170_2-DOUT: D170.2-DOUT(DO) D171.4-DIN(DI)
NetD171_2-DOUT: D171.2-DOUT(DO) D172.4-DIN(DI)
NetD172_2-DOUT: D172.2-DOUT(DO) D173.4-DIN(DI)
NetD173_2-DOUT: D173.2-DOUT(DO) D174.4-DIN(DI)
NetD174_2-DOUT: D174.2-DOUT(DO) D175.4-DIN(DI)
NetD175_2-DOUT: D175.2-DOUT(DO) D176.4-DIN(DI)
NetD176_2-DOUT: D176.2-DOUT(DO) D177.4-DIN(DI)
NetD177_2-DOUT: D177.2-DOUT(DO) D178.4-DIN(DI)
NetD178_2-DOUT: D178.2-DOUT(DO) D179.4-DIN(DI)
NetD179_2-DOUT: D179.2-DOUT(DO) D180.4-DIN(DI)
NetD180_2-DOUT: D180.2-DOUT(DO) D181.4-DIN(DI)
NetD181_2-DOUT: D181.2-DOUT(DO) D182.4-DIN(DI)
NetD182_2-DOUT: D182.2-DOUT(DO) D183.4-DIN(DI)
NetD183_2-DOUT: D183.2-DOUT(DO) D184.4-DIN(DI)
NetD184_2-DOUT: D184.2-DOUT(DO) D185.4-DIN(DI)
NetD185_2-DOUT: D185.2-DOUT(DO) D186.4-DIN(DI)
NetD186_2-DOUT: D186.2-DOUT(DO) D187.4-DIN(DI)
NetD187_2-DOUT: D187.2-DOUT(DO) D188.4-DIN(DI)
NetD188_2-DOUT: D188.2-DOUT(DO) D189.4-DIN(DI)
NetD189_2-DOUT: D189.2-DOUT(DO) D190.4-DIN(DI)
NetD190_2-DOUT: D190.2-DOUT(DO) D191.4-DIN(DI)
NetD191_2-DOUT: D191.2-DOUT(DO) D192.4-DIN(DI)

### Notes on the sheet
- RGB Rows 7 & 8
- RGB Matrix
- HM

### Library data of the parts
C145-C192 = C0603C104K5RAC7411: as C1 on sheet RGBM-01; Part Number: C0603C104K5RAC7411; Capacitance: 0.1 µF; Applications: Bypass, Decoupling; componentlink1description: Datasheet; componentlink1url: https://api.kemet.com/component-edge/download/datasheet/C0603C104K5RAC7411.pdf; componentlink2description: DigiKey Link; componentlink2url: https://www.digikey.com/en/products/detail/kemet/C0603C104K5RAC7411/3317013; Device Package: 0603 (1608 Metric); lastupdated: 2026-04-06 7:23:52 PM; Lifecycle Status: Active; Minimum Order: 1; Mounting Type: Surface Mount, MLCC; Operating Temperature: -55°C ~ 125°C; Package / Case: 0603 (1608 Metric); packaging: TapeAndReel; partid: 2233; Part Status: Active; price: 0.01; series: SMD Comm X7R; Size / Dimension: 0.063" L x 0.031" W (1.60mm x 0.80mm); Supplier 1: DigiKey; Supplier Part Number 1: 399-C0603C104K5RAC7411CT-ND; Temperature Coefficient: X7R; Thickness (Max): 0.035" (0.90mm); value: 0.1 µF; Voltage - Rated: 50V
D145-D192 = WS2812B: as D1 on sheet RGBM-01; SnapEDA_Link: https://www.snapeda.com/parts/WS2812B/Worldsemi/view-part/?ref=snap; Package: None; MP: WS2812B; Check_prices: https://www.snapeda.com/parts/WS2812B/Worldsemi/view-part/?ref=eda; Value: *
R9-R11 = YJP1608-R001: as R1 on sheet RGBM-01; Part Number: YJP1608-R001; ComponentLink1Description: Datasheet; ComponentLink1URL: http://www.susumu.co.jp/common/pdf/n_catalog_partition10_en.pdf; ComponentLink2Description: DigiKey Link; ComponentLink2URL: https://www.digikey.com/en/products/detail/susumu/YJP1608-R001/2815047; Composition: Thin Film; Device Package: 0603 (1608 Metric); Height - Seated (Max): 0.016" (0.40mm); LastUpdated: 2024-02-09 8:42:50 PM; Lifecycle Status: Active; Minimum Order: 1; Number of Terminations: 2; Operating Temperature: -40°C ~ 125°C; Package / Case: 0603 (1608 Metric); Packaging: TapeAndReel; PartId: 16802; Part Status: Active; Price: 0.08; Resistance: 0 Ohms; Series: YJP; Size / Dimension: 0.063" L x 0.031" W (1.60mm x 0.80mm); Supplier 1: DigiKey; Supplier Part Number 1: 408-1515-1-ND; Supplier Device Package: 0603; Tolerance: Jumper